# EAGLE board electrosteel2020_controlonly (EAGLE 9.2.2), part 1 of 3
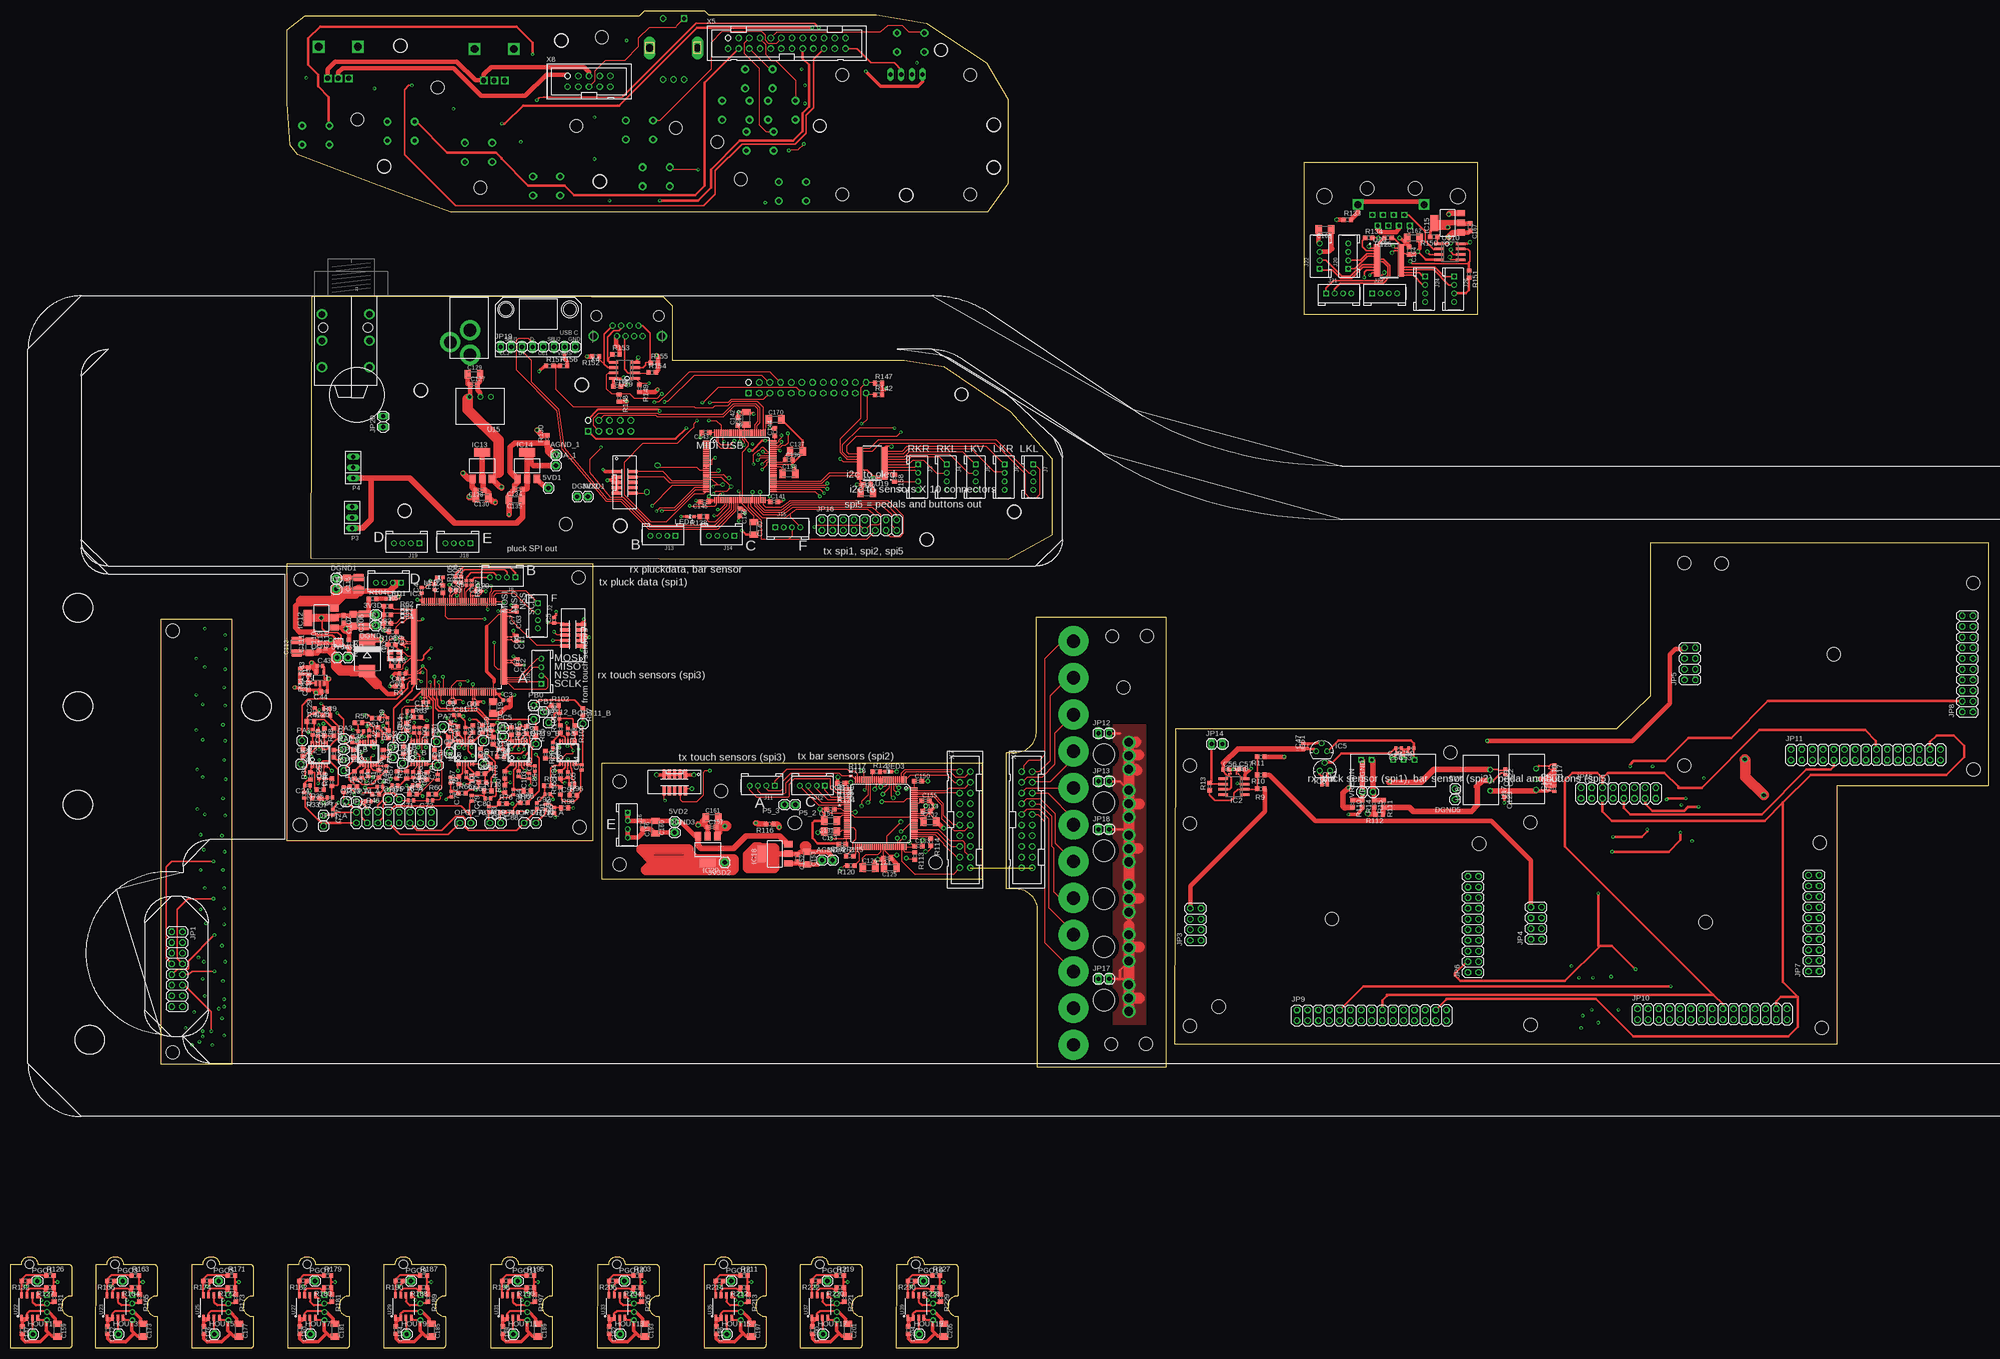
[diagram p7: board, top side]
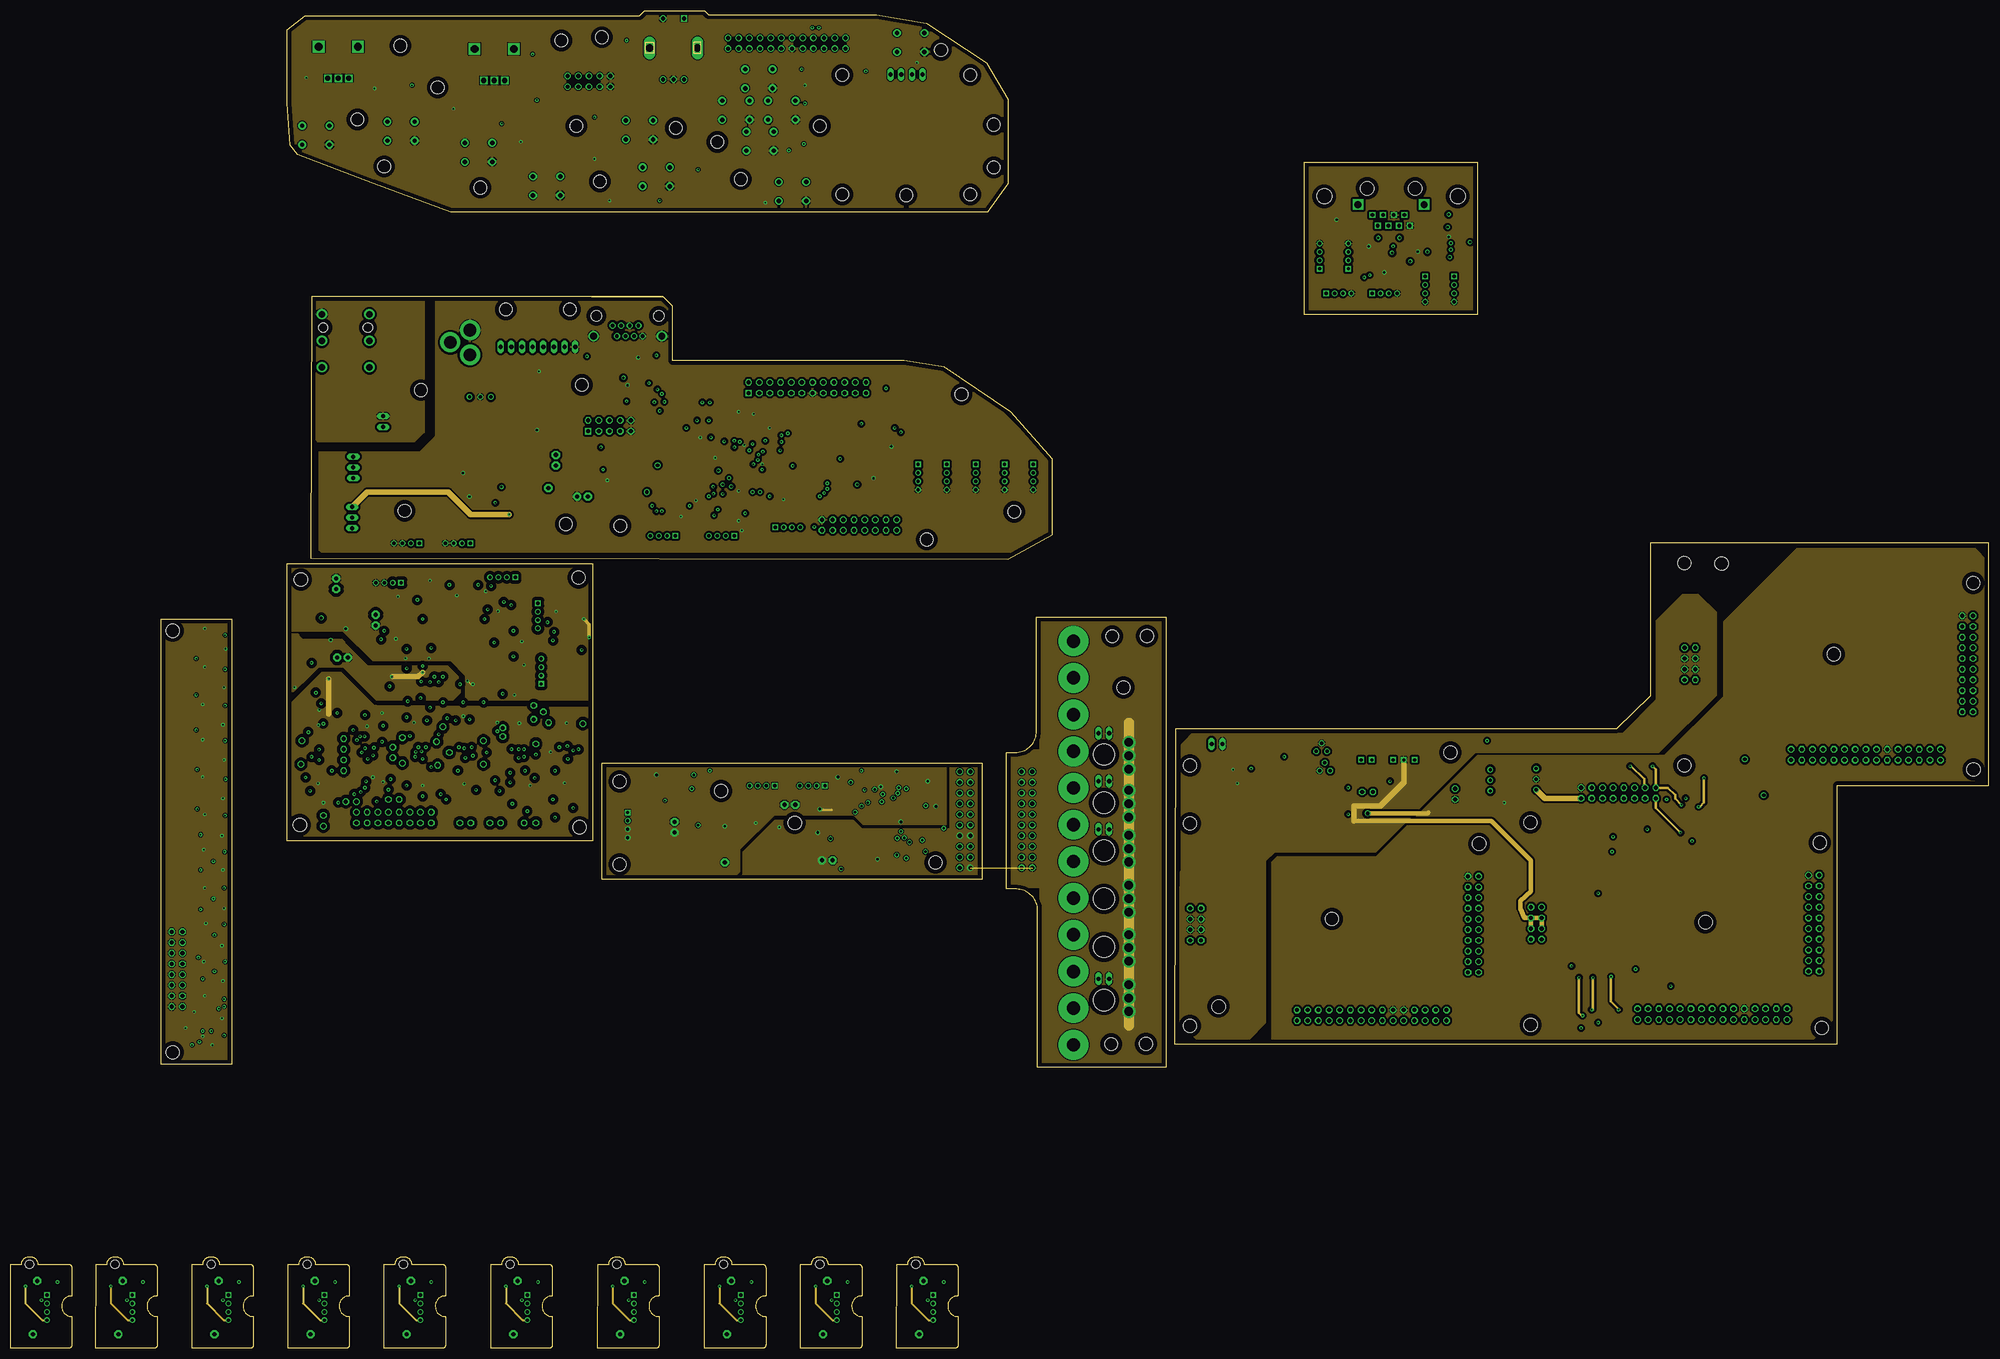
[diagram p8: board, inner layer Route2]
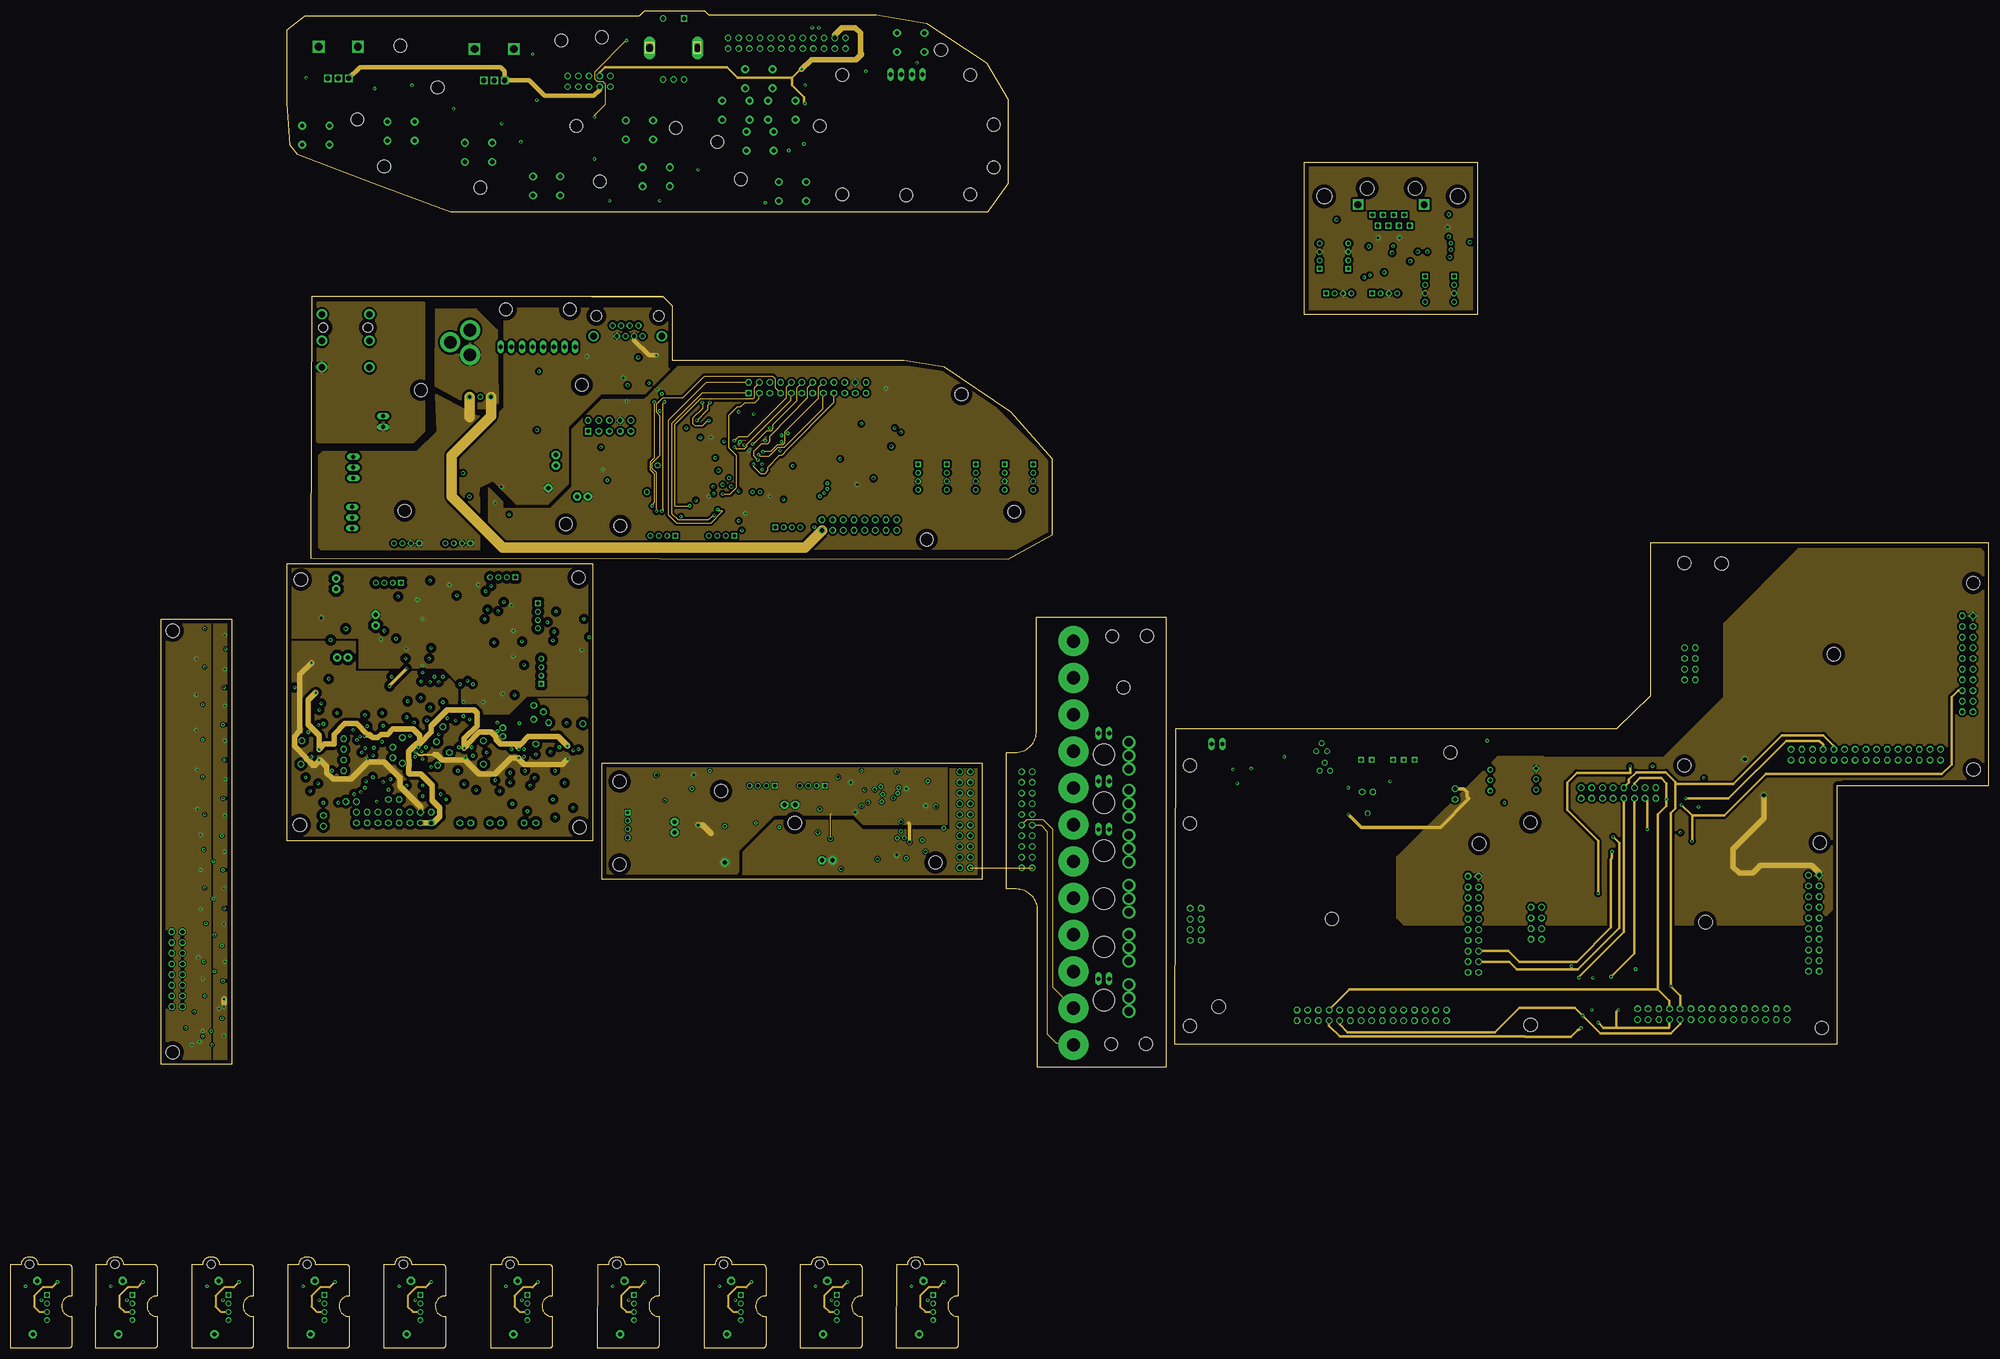
[diagram p9: board, inner layer Route15]
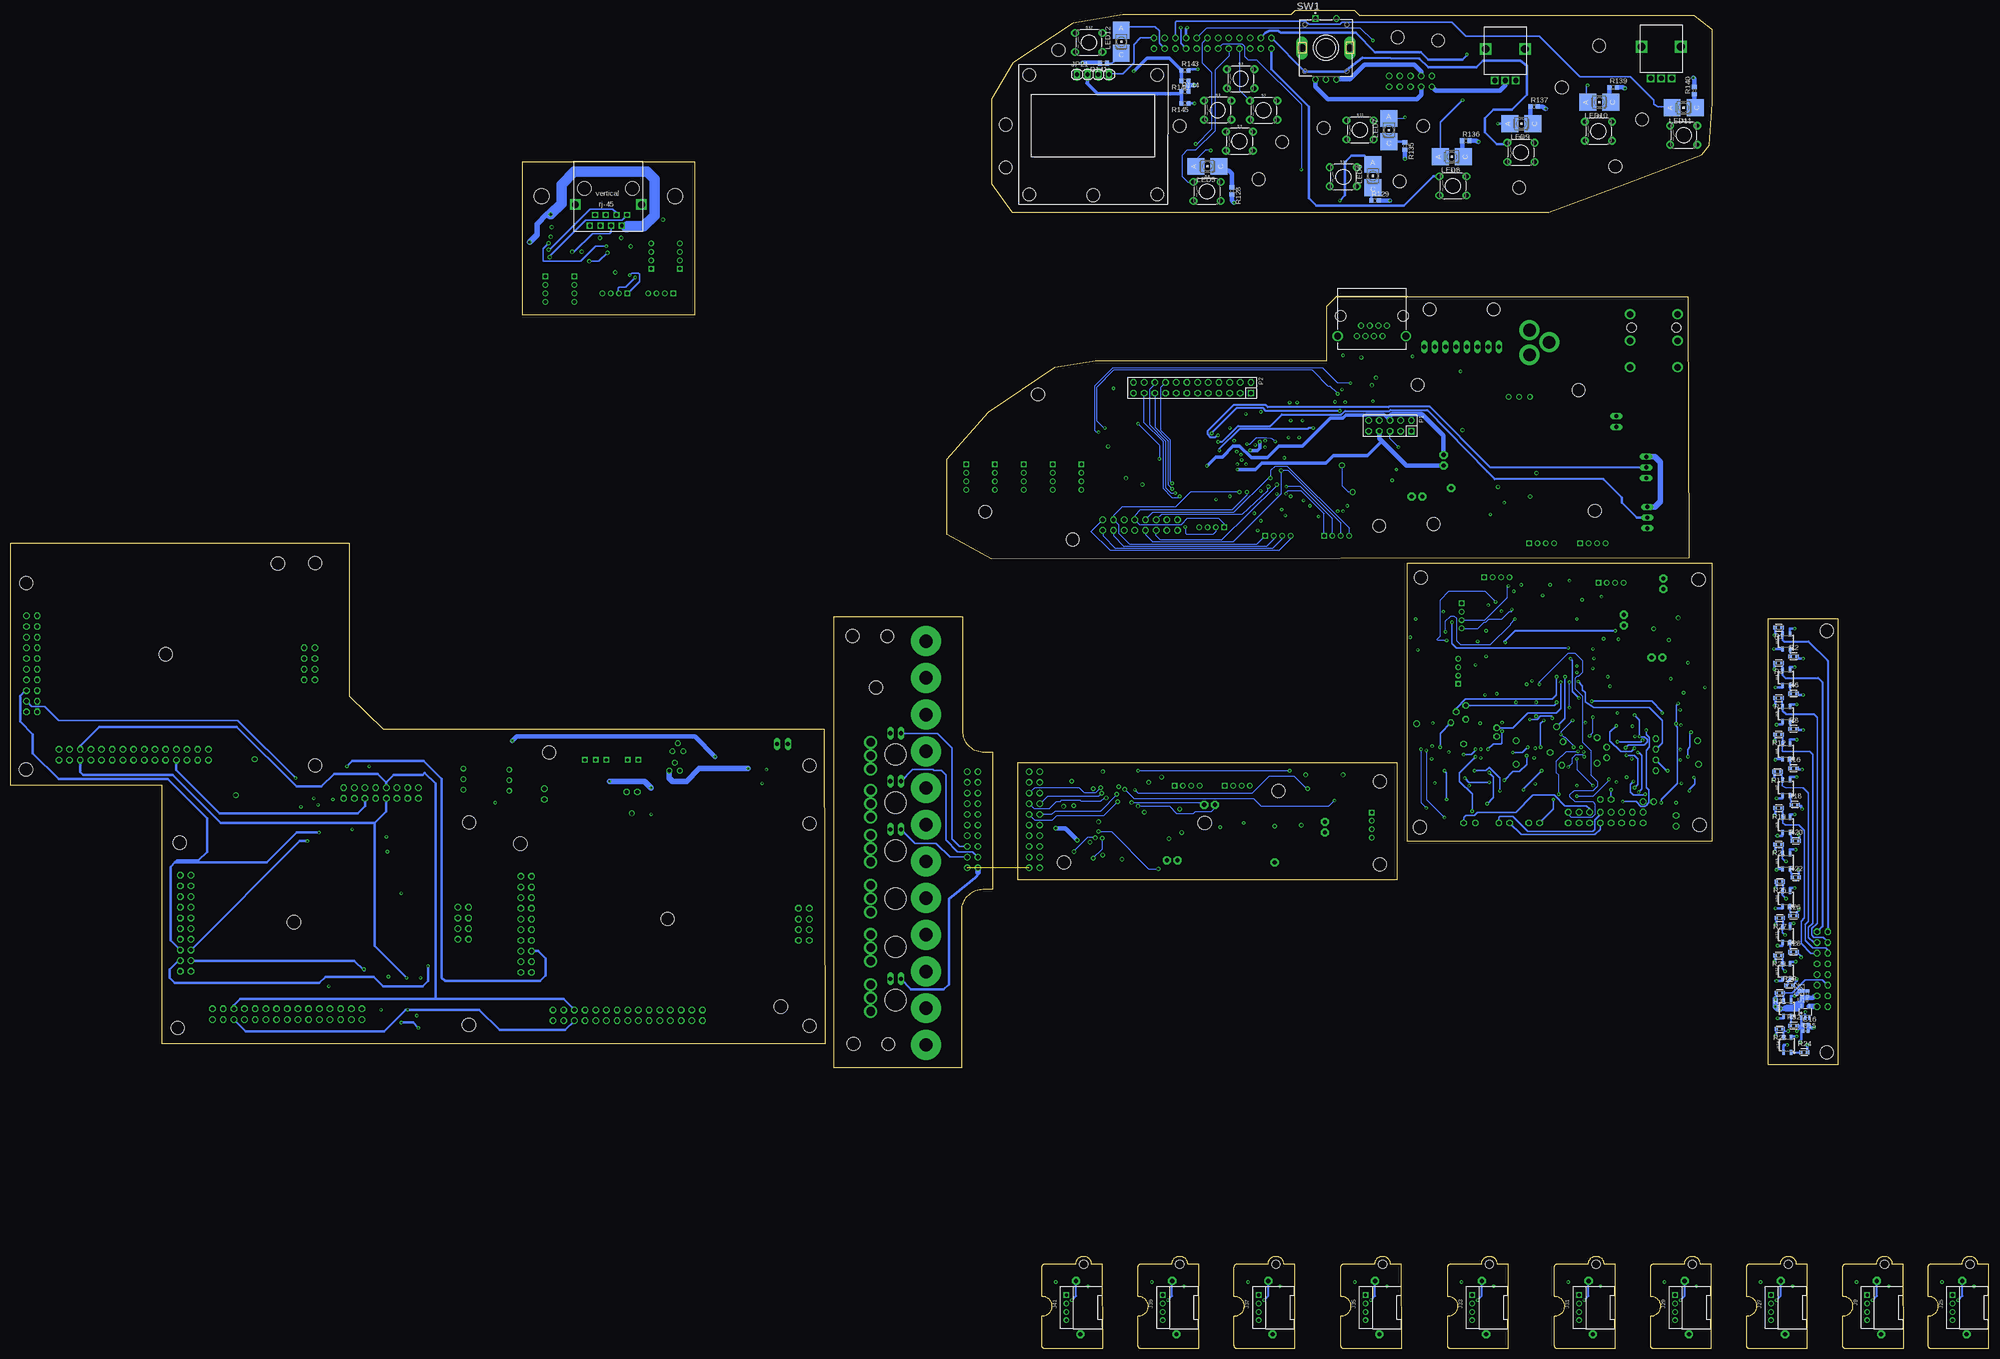
[diagram p10: board, bottom side, seen from below]

Size 470.66 x 318.31 mm. Coordinates in mm from the lower left corner, seen from the top.
Outline: 213 segments
Copper layers (1+2*15+16): Top 0.035mm / dielectric 0.5mm / Route2 0.035mm / dielectric 0.5mm / Route15 0.035mm / dielectric 0.5mm / Bottom 0.035mm
Design rules "default *": minimum track width 6mil, minimum drill 0.35mm, track to track 9mil, track to pad 9mil, pad to pad 9mil, via to via 9mil, smd to smd 9mil, copper to edge 40mil, drill to drill 6mil, minimum pad ring 10mil, minimum via ring 8mil, stop-mask expansion 4mil, vias tented up to drill 0mil, thermal gap 10mil
Holes 3.17 mm at 280.54,124.89 349.38,120.07 280.54,76.76 361.57,125.15 430.4,120.32 361.62,76.99 398.15,186.89 466.95,182.07 398.22,138.71 270.13,72.44 144.91,134.92 264.8,157.28 68.83,124.51 69.09,182.93 135.13,183.44 135.38,124 314.32,102.16 403.23,101.4 433.71,165.15 342.52,141.78 280.54,138.73 466.98,137.72 407.04,186.74 287.4,81.33 430.91,76.25 270.38,169.47 186.56,125.02 220.09,115.62 169.04,132.64 144.91,115.11 38.61,170.74 38.61,70.41
Holes 5.08 mm at 260.1,141.27 260.1,129.84 260.1,118.41 260.1,106.98 260.1,95.55 260.1,82.85
Holes 2.03 mm at 4.55,20.02 24.87,20.02 47.73,20.02 70.59,20.02 93.45,20.02 118.85,20.02 144.25,20.02 169.65,20.02 192.51,20.02 215.37,20.02
Holes 3.56 mm at 312.55,274.12 344.3,274.12
Holes 3.05 mm at 117.86,247.19 133.1,247.19 197.91,274.57 228.31,274.57 228.31,302.97 197.91,302.97 221.36,308.91 233.93,291.13 192.53,290.88 213.11,274.37 140.21,277.67 88.9,281.23 131.06,311.2 92.71,309.93 97.58,227.99 135.94,229.26 93.77,199.29 145.08,195.72 217.97,192.43 226.24,226.96 233.93,280.97 238.81,199.03 111.76,276.15 101.6,300.02 82.55,292.4 134.62,290.88 158.24,290.37 173.74,278.18 168.15,287.07 140.72,311.96 132.08,196.14 261.87,72.44 262.13,169.47

## Footprints (pad centres in the part's own frame; a part is rotated, then mirrored left to right if it is on the bottom)
1X01 = drill 1.016 pad 1.93 octagon: 1 0,0
1X01' = drill 1.016 octagon: 1 0,0
C0402 = smd 0.7 x 0.9: 1 -0.65,0; 2 0.65,0
C0201 = smd 0.25 x 0.35: 1 -0.25,0; 2 0.25,0
C0603 = smd 1.1 x 1: 1 -0.85,0; 2 0.85,0
C1206 = smd 1.6 x 1.8: 1 -1.4,0; 2 1.4,0
SMC_B = smd 1.6 x 2.4: + -1.5,0; - 1.5,0
C0603K = smd 1.05 x 1.08: 1 -0.875,0; 2 0.875,0
C1206K = smd 1.5 x 2: 1 -1.5,0; 2 1.5,0
SMC = smd 2.8 x 3.8: A 3.7,0; C -3.7,0
TSSOP14 = smd 0.305 x 0.991: 1 -1.905,-2.718; 2 -1.27,-2.718; 3 -0.635,-2.718; 4 0,-2.718; 5 0.635,-2.718; 6 1.27,-2.718; 7 1.905,-2.718; 8 1.905,2.718; 9 1.27,2.718; 10 0.635,2.718; 11 0,2.718; 12 -0.635,2.718; 13 -1.27,2.718; 14 -1.905,2.718
SO08 = smd 0.6 x 2.2: 1 -1.905,-2.6; 2 -0.635,-2.6; 3 0.635,-2.6; 4 1.905,-2.6; 5 1.905,2.6; 6 0.635,2.6; 7 -0.635,2.6; 8 -1.905,2.6
QFP50P2200X2200X160-144N = smd 1.56 x 0.28: 1 -10.68,8.75; 2 -10.68,8.25; 3 -10.68,7.75; 4 -10.68,7.25; 5 -10.68,6.75; 6 -10.68,6.25; 7 -10.68,5.75; 8 -10.68,5.25; 9 -10.68,4.75; 10 -10.68,4.25; 11 -10.68,3.75; 12 -10.68,3.25; 13 -10.68,2.75; 14 -10.68,2.25; 15 -10.68,1.75; 16 -10.68,1.25; 17 -10.68,0.75; 18 -10.68,0.25; 19 -10.68,-0.25; 20 -10.68,-0.75; 21 -10.68,-1.25; 22 -10.68,-1.75; 23 -10.68,-2.25; 24 -10.68,-2.75; 25 -10.68,-3.25; 26 -10.68,-3.75; 27 -10.68,-4.25; 28 -10.68,-4.75; 29 -10.68,-5.25; 30 -10.68,-5.75; 31 -10.68,-6.25; 32 -10.68,-6.75; 33 -10.68,-7.25; 34 -10.68,-7.75; 35 -10.68,-8.25; 36 -10.68,-8.75; 73 10.68,-8.75; 74 10.68,-8.25; 75 10.68,-7.75; 76 10.68,-7.25; 77 10.68,-6.75; 78 10.68,-6.25; 79 10.68,-5.75; 80 10.68,-5.25; 81 10.68,-4.75; 82 10.68,-4.25; 83 10.68,-3.75; 84 10.68,-3.25; 85 10.68,-2.75; 86 10.68,-2.25; 87 10.68,-1.75; 88 10.68,-1.25; 89 10.68,-0.75; 90 10.68,-0.25; 91 10.68,0.25; 92 10.68,0.75; 93 10.68,1.25; 94 10.68,1.75; 95 10.68,2.25; 96 10.68,2.75; 97 10.68,3.25; 98 10.68,3.75; 99 10.68,4.25; 100 10.68,4.75; 101 10.68,5.25; 102 10.68,5.75; 103 10.68,6.25; 104 10.68,6.75; 105 10.68,7.25; 106 10.68,7.75; 107 10.68,8.25; 108 10.68,8.75 | smd 0.28 x 1.56: 37 -8.75,-10.68; 38 -8.25,-10.68; 39 -7.75,-10.68; 40 -7.25,-10.68; 41 -6.75,-10.68; 42 -6.25,-10.68; 43 -5.75,-10.68; 44 -5.25,-10.68; 45 -4.75,-10.68; 46 -4.25,-10.68; 47 -3.75,-10.68; 48 -3.25,-10.68; 49 -2.75,-10.68; 50 -2.25,-10.68; 51 -1.75,-10.68; 52 -1.25,-10.68; 53 -0.75,-10.68; 54 -0.25,-10.68; 55 0.25,-10.68; 56 0.75,-10.68; 57 1.25,-10.68; 58 1.75,-10.68; 59 2.25,-10.68; 60 2.75,-10.68; 61 3.25,-10.68; 62 3.75,-10.68; 63 4.25,-10.68; 64 4.75,-10.68; 65 5.25,-10.68; 66 5.75,-10.68; 67 6.25,-10.68; 68 6.75,-10.68; 69 7.25,-10.68; 70 7.75,-10.68; 71 8.25,-10.68; 72 8.75,-10.68; 109 8.75,10.68; 110 8.25,10.68; 111 7.75,10.68; 112 7.25,10.68; 113 6.75,10.68; 114 6.25,10.68; 115 5.75,10.68; 116 5.25,10.68; 117 4.75,10.68; 118 4.25,10.68; 119 3.75,10.68; 120 3.25,10.68; 121 2.75,10.68; 122 2.25,10.68; 123 1.75,10.68; 124 1.25,10.68; 125 0.75,10.68; 126 0.25,10.68; 127 -0.25,10.68; 128 -0.75,10.68; 129 -1.25,10.68; 130 -1.75,10.68; 131 -2.25,10.68; 132 -2.75,10.68; 133 -3.25,10.68; 134 -3.75,10.68; 135 -4.25,10.68; 136 -4.75,10.68; 137 -5.25,10.68; 138 -5.75,10.68; 139 -6.25,10.68; 140 -6.75,10.68; 141 -7.25,10.68; 142 -7.75,10.68; 143 -8.25,10.68; 144 -8.75,10.68
SOT23-5 = smd 0.6 x 1.2: 1 -0.95,-1.306; 2 0,-1.306; 3 0.95,-1.306; 4 0.95,1.306; 5 -0.95,1.306
78LXX = drill 0.813 octagon: GND 0,1.905; IN 1.27,0; OUT -1.27,0
79LXX = drill 0.813 octagon: GND -1.27,0; IN 0,1.905; OUT 1.27,0
6-WSON = smd 0.45 x 0.3: 1 -0.975,0.65; 2 -0.975,0; 3 -0.975,-0.65; 4 0.975,-0.65; 5 0.975,0; 6 0.975,0.65 | smd 0.9 x 1.6: PAD 0,0
SOT223 = smd 1.499 x 2.007: 1 -2.261,-3.15; 2 0.025,-3.15; 3 2.311,-3.15 | smd 3.81 x 2.007: PAD 0,3.15
AUDIO_JACK_0.25"_TRS_PTH_RA = drill 1.6: RING 10.5,-6.95; RING-NORM 10.5,4.35; SLEEVE 4.2,-6.95; SLEEVE-NORM 4.2,4.35; TIP 16.8,-6.95; TIP-NORM 16.8,4.35 | hole 2.2: 7.4,4; 7.4,-6.6
HW4-2.0 = drill 0.8 pad 1.27 square: 1 -3,0 | drill 0.8 pad 1.27: 2 -1,0; 3 1,0; 4 3,0
HW4-2.0-90D = drill 0.8 pad 1.27 square: 1 -3,0 | drill 0.8 pad 1.27: 2 -1,0; 3 1,0; 4 3,0
2X08 = drill 1.016 octagon: 1 -8.89,-1.27; 2 -8.89,1.27; 3 -6.35,-1.27; 4 -6.35,1.27; 5 -3.81,-1.27; 6 -3.81,1.27; 7 -1.27,-1.27; 8 -1.27,1.27; 9 1.27,-1.27; 10 1.27,1.27; 11 3.81,-1.27; 12 3.81,1.27; 13 6.35,-1.27; 14 6.35,1.27; 15 8.89,-1.27; 16 8.89,1.27
2X04 = drill 1.016 octagon: 1 -3.81,-1.27; 2 -3.81,1.27; 3 -1.27,-1.27; 4 -1.27,1.27; 5 1.27,-1.27; 6 1.27,1.27; 7 3.81,-1.27; 8 3.81,1.27
2X10 = drill 1.016 octagon: 1 -11.43,-1.27; 2 -11.43,1.27; 3 -8.89,-1.27; 4 -8.89,1.27; 5 -6.35,-1.27; 6 -6.35,1.27; 7 -3.81,-1.27; 8 -3.81,1.27; 9 -1.27,-1.27; 10 -1.27,1.27; 11 1.27,-1.27; 12 1.27,1.27; 13 3.81,-1.27; 14 3.81,1.27; 15 6.35,-1.27; 16 6.35,1.27; 17 8.89,-1.27; 18 8.89,1.27; 19 11.43,-1.27; 20 11.43,1.27
2X15 = drill 1.016 octagon: 1 -17.78,-1.27; 2 -17.78,1.27; 3 -15.24,-1.27; 4 -15.24,1.27; 5 -12.7,-1.27; 6 -12.7,1.27; 7 -10.16,-1.27; 8 -10.16,1.27; 9 -7.62,-1.27; 10 -7.62,1.27; 11 -5.08,-1.27; 12 -5.08,1.27; 13 -2.54,-1.27; 14 -2.54,1.27; 15 0,-1.27; 16 0,1.27; 17 2.54,-1.27; 18 2.54,1.27; 19 5.08,-1.27; 20 5.08,1.27; 21 7.62,-1.27; 22 7.62,1.27; 23 10.16,-1.27; 24 10.16,1.27; 25 12.7,-1.27; 26 12.7,1.27; 27 15.24,-1.27; 28 15.24,1.27; 29 17.78,-1.27; 30 17.78,1.27
1X02 = drill 1.016 long: 1 -1.27,0; 2 1.27,0
1X08 = drill 1.016 long: 1 -8.89,0; 2 -6.35,0; 3 -3.81,0; 4 -1.27,0; 5 1.27,0; 6 3.81,0; 7 6.35,0; 8 8.89,0
1X04 = drill 1.016 long: 1 -3.81,0; 2 -1.27,0; 3 1.27,0; 4 3.81,0
CHIP-LED0603 = smd 0.8 x 0.8: A 0,-0.75; C 0,0.75
P-LCC-2 = smd 4 x 4: A 0,2.75; C 0,-2.75
DIL-100-2X05_M = drill 1.016 square: 1 -5.08,1.27 | drill 1.016 octagon: 2 -5.08,-1.27; 3 -2.54,1.27; 4 -2.54,-1.27; 5 0,1.27; 6 0,-1.27; 7 2.54,1.27; 8 2.54,-1.27; 9 5.08,1.27; 10 5.08,-1.27
DIL-100-2X12_M = drill 1.016 square: 1 -13.97,1.27 | drill 1.016 octagon: 2 -13.97,-1.27; 3 -11.43,1.27; 4 -11.43,-1.27; 5 -8.89,1.27; 6 -8.89,-1.27; 7 -6.35,1.27; 8 -6.35,-1.27; 9 -3.81,1.27; 10 -3.81,-1.27; 11 -1.27,1.27; 12 -1.27,-1.27; 13 1.27,1.27; 14 1.27,-1.27; 15 3.81,1.27; 16 3.81,-1.27; 17 6.35,1.27; 18 6.35,-1.27; 19 8.89,1.27; 20 8.89,-1.27; 21 11.43,1.27; 22 11.43,-1.27; 23 13.97,1.27; 24 13.97,-1.27
SIP-100-03-40Y = drill 1.016 long: 1 -2.54,0; 2 0,0; 3 2.54,0
NX3225 = smd 1.4 x 1.2: 1 -1.1,-0.8; 2 1.1,-0.8; 3 1.1,0.8; 4 -1.1,0.8
RESC1608X60 = smd 0.799 x 0.974: 1 -0.815,0; 2 0.815,0
R0603 = smd 1 x 1.1: 1 -0.85,0; 2 0.85,0
R0402 = smd 0.7 x 0.9: 1 -0.55,0; 2 0.55,0
R0201 = smd 0.28 x 0.43: 1 -0.255,0; 2 0.255,0
TACTILE_SWITCH_PTH_6.0MM = drill 1.016 pad 1.88: 1 -3.251,2.261; 2 3.251,2.261; 3 -3.251,-2.261; 4 3.251,-2.261
PEC11R-4215F-S0024 = drill 1 square: 1 -2.5,7 | drill 1: 2 2.5,7; A -2.5,-7.5; B 2.5,-7.5; C 0,-7.5 | drill 1.8 long: P1 -5.7,0; P2 5.7,0
TQFP-100-14X14MM = smd 1.5 x 0.27: 1 -8,6; 2 -8,5.5; 3 -8,5; 4 -8,4.5; 5 -8,4; 6 -8,3.5; 7 -8,3; 8 -8,2.5; 9 -8,2; 10 -8,1.5; 11 -8,1; 12 -8,0.5; 13 -8,0; 14 -8,-0.5; 15 -8,-1; 16 -8,-1.5; 17 -8,-2; 18 -8,-2.5; 19 -8,-3; 20 -8,-3.5; 21 -8,-4; 22 -8,-4.5; 23 -8,-5; 24 -8,-5.5; 25 -8,-6; 51 8,-6; 52 8,-5.5; 53 8,-5; 54 8,-4.5; 55 8,-4; 56 8,-3.5; 57 8,-3; 58 8,-2.5; 59 8,-2; 60 8,-1.5; 61 8,-1; 62 8,-0.5; 63 8,0; 64 8,0.5; 65 8,1; 66 8,1.5; 67 8,2; 68 8,2.5; 69 8,3; 70 8,3.5; 71 8,4; 72 8,4.5; 73 8,5; 74 8,5.5; 75 8,6 | smd 0.27 x 1.5: 26 -6,-8; 27 -5.5,-8; 28 -5,-8; 29 -4.5,-8; 30 -4,-8; 31 -3.5,-8; 32 -3,-8; 33 -2.5,-8; 34 -2,-8; 35 -1.5,-8; 36 -1,-8; 37 -0.5,-8; 38 0,-8; 39 0.5,-8; 40 1,-8; 41 1.5,-8; 42 2,-8; 43 2.5,-8; 44 3,-8; 45 3.5,-8; 46 4,-8; 47 4.5,-8; 48 5,-8; 49 5.5,-8; 50 6,-8; 76 6,8; 77 5.5,8; 78 5,8; 79 4.5,8; 80 4,8; 81 3.5,8; 82 3,8; 83 2.5,8; 84 2,8; 85 1.5,8; 86 1,8; 87 0.5,8; 88 0,8; 89 -0.5,8; 90 -1,8; 91 -1.5,8; 92 -2,8; 93 -2.5,8; 94 -3,8; 95 -3.5,8; 96 -4,8; 97 -4.5,8; 98 -5,8; 99 -5.5,8; 100 -6,8
QRE1113 = smd 1.2 x 0.6: 1 -1.8,-0.9; 2 1.8,-0.9; 3 1.8,0.9; 4 -1.8,0.9
DC-DC_CONVERTER_78XX = drill 0.8: GND 0,0; VIN -2.54,0; VOUT 2.54,0
TEXAS_SOT23-5 = smd 0.55 x 1.2: 1 -0.95,-1.3; 2 0,-1.3; 3 0.95,-1.3; 4 0.95,1.3; 5 -0.95,1.3
SOP65P640X120-24N = smd 1.57 x 0.41: 1 -2.87,3.575; 2 -2.87,2.925; 3 -2.87,2.275; 4 -2.87,1.625; 5 -2.87,0.975; 6 -2.87,0.325; 7 -2.87,-0.325; 8 -2.87,-0.975; 9 -2.87,-1.625; 10 -2.87,-2.275; 11 -2.87,-2.925; 12 -2.87,-3.575; 13 2.87,-3.575; 14 2.87,-2.925; 15 2.87,-2.275; 16 2.87,-1.625; 17 2.87,-0.975; 18 2.87,-0.325; 19 2.87,0.325; 20 2.87,0.975; 21 2.87,1.625; 22 2.87,2.275; 23 2.87,2.925; 24 2.87,3.575
SOIC8-1.27-5X4MM = smd 0.6 x 1.4: 1 -1.905,-2.7; 2 -0.635,-2.7; 3 0.635,-2.7; 4 1.905,-2.7; 5 1.905,2.7; 6 0.635,2.7; 7 -0.635,2.7; 8 -1.905,2.7
RK09 = drill 1.2 square: 1-09 -2.5,-7.5; 2-09 0,-7.5; 3-09 2.5,-7.5 | drill 1.854 square: MOUNT1 -4.683,0; MOUNT2 4.683,0
CMR0512S3C = drill 0.8 square: P$1 -7.62,0; P$2 -5.08,0; P$3 0,0; P$4 2.54,0; P$5 5.08,0
SS-7188VS-A-FLS_RJ45 = drill 0.889 square: P$1 -4.445,4.445; P$2 -3.175,6.985; P$3 -1.905,4.445; P$4 -0.635,6.985; P$5 0.635,4.445; P$6 1.905,6.985; P$7 3.175,4.445; P$8 4.445,6.985 | drill 1.651 square: P$9 -7.874,1.981; P$10 7.874,1.981 | hole 3.277: -5.715,-1.905; 5.715,-1.905
SO8 = smd 0.6 x 2.2: 1 -1.905,-2.6; 2 -0.635,-2.6; 3 0.635,-2.6; 4 1.905,-2.6; 5 1.905,2.6; 6 0.635,2.6; 7 -0.635,2.6; 8 -1.905,2.6
PJ-102A = drill 3 pad 4.8: RING 0.1,-3.39; RING_SW -4.6,-6.29; TIP 0.1,-9.29
3221-10-0300-00 = smd 0.76 x 2.4: 1 -2.54,-1.87; 2 -2.54,1.97; 3 -1.27,-1.87; 4 -1.27,1.97; 5 0,-1.87; 6 0,1.97; 7 1.27,-1.87; 8 1.27,1.97; 9 2.54,-1.87; 10 2.54,1.97
GLX-S-88M = drill 0.9 pad 1.422: 1 -3.57,-2.3; 2 -2.55,-4.84; 3 -1.53,-2.3; 4 -0.51,-4.84; 5 0.51,-2.3; 6 1.53,-4.84; 7 2.55,-2.3; 8 3.57,-4.84 | drill 1.6 pad 2.184: S1 -8.125,-4.84; S2 8.125,-4.84 | hole 2.55: -7.44,0; 7.44,0
PAK100/2500-24 = drill 1 pad 1.422: 1 -13.97,-1.27; 2 -13.97,1.27; 3 -11.43,-1.27; 4 -11.43,1.27; 5 -8.89,-1.27; 6 -8.89,1.27; 7 -6.35,-1.27; 8 -6.35,1.27; 9 -3.81,-1.27; 10 -3.81,1.27; 11 -1.27,-1.27; 12 -1.27,1.27; 13 1.27,-1.27; 14 1.27,1.27; 15 3.81,-1.27; 16 3.81,1.27; 17 6.35,-1.27; 18 6.35,1.27; 19 8.89,-1.27; 20 8.89,1.27; 21 11.43,-1.27; 22 11.43,1.27; 23 13.97,-1.27; 24 13.97,1.27
PAK100/2500-20 = drill 1 pad 1.422: 1 -11.43,-1.27; 2 -11.43,1.27; 3 -8.89,-1.27; 4 -8.89,1.27; 5 -6.35,-1.27; 6 -6.35,1.27; 7 -3.81,-1.27; 8 -3.81,1.27; 9 -1.27,-1.27; 10 -1.27,1.27; 11 1.27,-1.27; 12 1.27,1.27; 13 3.81,-1.27; 14 3.81,1.27; 15 6.35,-1.27; 16 6.35,1.27; 17 8.89,-1.27; 18 8.89,1.27; 19 11.43,-1.27; 20 11.43,1.27
PAK100/2500-10 = drill 1 pad 1.422: 1 -5.08,-1.27; 2 -5.08,1.27; 3 -2.54,-1.27; 4 -2.54,1.27; 5 0,-1.27; 6 0,1.27; 7 2.54,-1.27; 8 2.54,1.27; 9 5.08,-1.27; 10 5.08,1.27

## Placement (x,y rotation side)
3V3A  [1X01]  77.72,164.39 0 top
3V3A_1  [1X01]  129.73,210.03 0 top
3V3A_2  [1X01]  195.58,116.13 0 top
3V3D  [1X01]  86.87,174.55 0 top
3V3D1  [1X01]  137.35,202.67 0 top
3V3D2  [1X01]  169.93,115.62 180 top
5V  [1X01]  77.47,180.64 0 top
5V/1  PINHD-1X1  [1X01']  343.66,133.15 0 top
5VD1  [1X01]  127.96,204.7 0 top
5VD2  [1X01]  157.99,125.27 0 top
AGND  [1X01]  80.26,164.39 0 top
AGND_1  [1X01]  129.73,212.57 0 top
AGND_2  [1X01]  193.04,116.13 0 top
C1  .1uf  [C0402]  105.16,153.72 180 top
C2  .1uf  [C0402]  93.22,168.2 90 top
C3  .1uf  [C0402]  117.86,154.23 0 top
C4  .1uf  [C0402]  97.79,180.39 90 top
C5  .1uf  [C0402]  129.29,173.28 90 top
C6  .01uf  [C0201]  110.19,154.61 180 top
C7  .01uf  [C0201]  118.87,175.31 270 top
C8  .01uf  [C0201]  105.16,154.74 180 top
C9  .01uf  [C0201]  94.23,167.94 90 top
C10  .01uf  [C0201]  98.68,154.76 180 top
C11  .1uf  [C0402]  120.4,168.96 270 top
C12  .1uf  [C0402]  120.65,163.37 270 top
C13  .1uf  [C0402]  110.49,153.47 180 top
C14  .1uf  [C0402]  98.81,153.72 180 top
C15  .1uf  [C0402]  43.69,75.49 0 bottom
C16  .01uf  [C0402]  43.69,77.01 0 bottom
C17  18pf  [C0603]  90.68,167.44 180 top
C18  18pf  [C0603]  91.44,162.36 0 top
C19  2.2uf  [C1206]  114.81,152.45 270 top
C20  .1uf  [C0402]  111.25,180.14 0 top
C21  .01uf  [C0402]  43.18,84.38 90 bottom
C22  .1uf  [C0402]  44.45,84.38 90 bottom
C23  .1uf  [C0402]  69.85,131.62 270 top
C24  .1uf  [C0402]  70.61,133.91 180 top
C25  .1uf  [C0402]  74.68,136.19 90 top
C26  .1uf  [C0402]  75.95,131.11 180 top
C27  .1uf  [C0402]  76.71,127.56 270 top
C28  .1uf  [C0402]  75.18,152.2 180 top
C29  .1uf  [C0402]  72.39,151.69 90 top
C30  .1uf  [C0402]  71.88,146.61 270 top
C31  .1uf  [C0402]  68.83,161.09 270 top
C32  .1uf  [C0402]  68.83,157.78 270 top
C33  .1uf  [C0402]  79.25,132.89 270 top
C34  .1uf  [C0402]  83.57,136.45 270 top
C35  .1uf  [C0402]  87.88,133.65 0 top
C36  .1uf  [C0402]  89.41,137.97 90 top
C37  .1uf  [C0402]  85.09,130.1 180 top
C38  .1uf  [C0402]  83.31,146.86 180 top
C39  .1uf  [C0402]  89.66,149.4 90 top
C40  .1uf  [C0402]  81.28,144.83 270 top
C41  .1uf  [C0402]  85.09,136.7 270 top
C42  .1uf  [C0402]  85.34,146.35 270 top
C43  .1uf  [C0402]  73.66,162.36 0 top
C44  .1uf  [C0402]  74.68,156.26 180 top
C45  .1uf  [C0402]  73.41,136.19 270 top
C46  .1uf  [C0402]  73.15,146.35 270 top
C47  .1uf  [C0402]  307.59,143.31 90 top
C48  .1uf  [C0402]  312.67,134.16 0 top
C49  .1uf  [C0402]  330.2,142.8 180 top
C50  .1uf  [C0402]  333.25,142.8 180 top
C51  .01uf  [C0201]  308.61,143.31 90 top
C52  .01uf  [C0201]  312.67,135.18 0 top
C53  .01uf  [C0201]  332.74,141.78 180 top
C54  .01uf  [C0201]  330.45,141.78 180 top
C55  .1uf  [C0402]  105.41,180.45 0 top
C56  .1uf  [C0402]  289.05,137.72 0 top
C57  .1uf  [C0402]  292.86,137.72 0 top
C58  .01uf  [C0201]  290.07,136.7 0 top
C59  .01uf  [C0201]  291.85,136.7 0 top
C60  .1uf  [C0402]  91.44,133.91 180 top
C61  .1uf  [C0402]  95.76,136.45 270 top
C62  .1uf  [C0402]  96.27,133.91 0 top
C63  .1uf  [C0402]  120.4,175.82 270 top
C64  .01uf  [C0402]  93.22,160.58 180 top
C65  .01uf  [C0402]  92.68,159.31 180 top
C66  .01uf  [C0201]  119.13,168.96 270 top
C67  .01uf  [C0201]  119.15,163.45 270 top
C68  .01uf  [C0201]  109.73,179.12 0 top
C69  .01uf  [C0201]  104.67,179.12 0 top
C70  .1uf  [C0402]  101.6,135.94 90 top
C71  .1uf  [C0402]  95.25,130.35 180 top
C72  .1uf  [C0402]  99.82,130.35 180 top
C73  .1uf  [C0402]  96.01,147.12 90 top
C74  .1uf  [C0402]  95,151.69 180 top
C75  .1uf  [C0402]  104.9,131.88 270 top
C76  .1uf  [C0402]  104.65,135.18 270 top
C77  .1uf  [C0402]  109.73,135.69 270 top
C78  .1uf  [C0402]  114.3,138.48 90 top
C79  .1uf  [C0402]  109.73,130.86 270 top
C80  .1uf  [C0402]  113.54,130.86 180 top
C81  .1uf  [C0402]  106.1,150.73 0 top
C82  .1uf  [C0402]  104.65,147.88 270 top
C83  .1uf  [C0402]  113.79,128.32 270 top
C84  .1uf  [C0402]  119.63,132.38 270 top
C85  .1uf  [C0402]  123.44,136.19 270 top
C86  .1uf  [C0402]  124.71,137.97 90 top
C87  .1uf  [C0402]  117.09,127.56 180 top
C88  .1uf  [C0402]  120.14,127.56 180 top
C89  .1uf  [C0402]  114.55,147.62 90 top
C90  .1uf  [C0402]  116.59,142.54 0 top
C91  .1uf  [C0402]  125.22,129.08 270 top
C92  .1uf  [C0402]  127.76,131.88 180 top
C93  .1uf  [C0402]  133.6,134.16 180 top
C94  .1uf  [C0402]  135.89,138.23 90 top
C95  .1uf  [C0402]  127.25,128.83 270 top
C96  .1uf  [C0402]  129.29,128.07 90 top
C97  .1uf  [C0402]  129.03,143.56 270 top
C98  .1uf  [C0402]  130.56,150.42 90 top
C99  .1uf  [C0402]  97.28,136.45 270 top
C100  .1uf  [C0402]  97.28,147.12 270 top
C101  .1uf  [C0402]  108.46,136.45 270 top
C102  .1uf  [C0402]  108.2,147.12 270 top
C103  .1uf  [C0402]  120.9,136.7 270 top
C104  .1uf  [C0402]  120.9,146.86 270 top
C105  .1uf  [C0402]  132.59,136.45 270 top
C106  .1uf  [C0402]  132.59,146.86 270 top
C107  .1uf  [C0603]  79.25,173.53 270 top
C108  1uf  [C1206]  81.53,173.28 270 top
C109  10uf  [SMC_B]  84.07,173.28 270 top
C110  .1uf  [C0603]  73.41,166.93 90 top
C111  1uf  [C1206]  71.12,166.93 90 top
C112  10uf  [SMC_B]  68.07,166.93 90 top
C113  .1uf  [C0402]  74.93,167.13 90 top
C114  1uf  [C1206]  80.01,181.91 90 top
C115  10uf  [SMC_B]  82.8,181.91 90 top
C116  .01uf  [C0201]  76.45,167.18 90 top
C117  .1uf  [C0402]  367.28,138.23 270 top
C118  .1uf  [C0402]  367.28,133.15 90 top
C119  .01uf  [C0201]  366.01,138.23 270 top
C120  .01uf  [C0201]  366.04,133.2 90 top
C121  .01uf  [C0201]  354.58,137.21 270 top
C122  .1uf  [C0402]  355.6,137.21 270 top
C123  .1uf  [C0402]  355.35,131.88 270 top
C124  .1uf  [C0603K]  208.53,116.64 180 top
C125  1uf  [C1206K]  209.3,114.35 180 top
C126  1uf  [C1206K]  204.22,114.35 0 top
C127  .1uf  [C0603K]  110.24,229.41 0 top
C128  .1uf  [C0603K]  111.7,204.19 180 top
C129  10uf  [C1206K]  110.24,231.7 0 top
C130  10uf  [C1206K]  112.21,202.41 180 top
C131  1uf  [C1206K]  195.07,125.53 180 top
C132  1uf  [C1206K]  218.69,125.27 0 top
C133  .1uf  [C0603K]  215.99,119.52 0 top
C134  .1uf  [C0603K]  120.84,204.44 180 top
C135  10uf  [C1206K]  120.08,201.9 180 top
C136  .1uf  [C0603K]  185.17,211.38 0 top
C137  1uf  [C1206K]  186.94,213.41 0 top
C138  1uf  [C1206K]  185.17,208.08 0 top
C139  1uf  [C1206K]  175.01,221.28 90 top
C140  1uf  [C1206K]  176.78,195.12 270 top
C141  .1uf  [C0603K]  181.61,201.47 0 top
C142  .1uf  [C0603K]  172.97,220.52 90 top
C143  .1uf  [C0603K]  165.35,217.98 180 top
C144  .1uf  [C0603K]  181.86,217.98 90 top
C145  .1uf  [C0603K]  165.1,201.47 180 top
C146  .1uf  [C0603K]  173.48,198.93 270 top
C147  .1uf  [C0603K]  2.79,4.37 270 top
C148  .1uf  [C0603K]  197.59,134.44 180 top
C149  .1uf  [C0603K]  197.87,119.94 180 top
C150  .1uf  [C0603K]  215.9,134.92 0 top
C151  .1uf  [C0603K]  195.07,128.32 180 top
C152  .1uf  [C0603K]  187.2,116.64 270 top
C153  10uf  [C1206K]  189.48,116.64 270 top
C154  .1uf  [C0603K]  217.91,127.76 0 top
C155  2200pf  [C0603K]  217.68,130.35 0 top
C156  .1uf  [C0603K]  150.37,124.51 270 top
C157  .1uf  [C0603K]  166.88,124 0 top
C159  1uf  [C1206K]  11.18,4.37 270 top
C160  10uf  [C1206K]  153.42,124 270 top
C161  10uf  [C1206K]  166.88,126.29 0 top
C162  1uf  [C1206K]  333.76,264.21 0 top
C163  1uf  [C1206K]  195.07,122.99 180 top
C164  .1uf  [C0603K]  332.74,261.16 270 top
C165  .1uf  [C0603K]  203.71,205.54 0 top
C166  .1uf  [C0603K]  144.27,228.9 0 top
C167  .1uf  [C0603K]  347.22,266.75 270 top
C168  10uf  [C1206K]  312.67,266.24 180 top
C169  1uf  [C1206K]  203.71,203.5 0 top
C170  1uf  [C1206K]  181.86,221.03 0 top
C172  .1uf  [C0603K]  23.11,4.37 270 top
C173  1uf  [C1206K]  31.5,4.37 270 top
C176  .1uf  [C0603K]  45.97,4.37 270 top
C177  1uf  [C1206K]  54.36,4.37 270 top
C180  .1uf  [C0603K]  68.83,4.37 270 top
C181  1uf  [C1206K]  77.22,4.37 270 top
C184  .1uf  [C0603K]  91.69,4.37 270 top
C185  1uf  [C1206K]  100.08,4.37 270 top
C188  .1uf  [C0603K]  117.09,4.37 270 top
C189  1uf  [C1206K]  125.48,4.37 270 top
C192  .1uf  [C0603K]  142.49,4.37 270 top
C193  1uf  [C1206K]  150.88,4.37 270 top
C196  .1uf  [C0603K]  167.89,4.37 270 top
C197  1uf  [C1206K]  176.28,4.37 270 top
C200  .1uf  [C0603K]  190.75,4.37 270 top
C201  1uf  [C1206K]  199.14,4.37 270 top
C204  .1uf  [C0603K]  213.61,4.37 270 top
C205  1uf  [C1206K]  222,4.37 270 top
D3  MBRS340T3  [SMC]  84.84,164.9 270 top
DGND  [1X01]  86.87,172.01 180 top
DGND1  [1X01]  77.47,183.18 0 top
DGND2  [1X01]  134.81,202.67 0 top
DGND3  [1X01]  157.99,122.73 0 top
DGND5  PINHD-1X1  [1X01']  343.66,130.61 180 top
HOUT1  [1X01]  5.33,3.35 0 top
HOUT3  [1X01]  25.65,3.35 0 top
HOUT5  [1X01]  48.51,3.35 0 top
HOUT7  [1X01]  71.37,3.35 0 top
HOUT9  [1X01]  94.23,3.35 0 top
HOUT11  [1X01]  119.63,3.35 0 top
HOUT13  [1X01]  145.03,3.35 0 top
HOUT15  [1X01]  170.43,3.35 0 top
HOUT17  [1X01]  193.29,3.35 0 top
HOUT19  [1X01]  216.15,3.35 0 top
IC1  OPA4344E  [TSSOP14]  85.09,141.53 0 top
IC2  OPA134D  [SO08]  291.08,133.65 90 top
IC3  STM32H743ZIT6  [QFP50P2200X2200X160-144N]  106.68,166.93 0 top
IC4  LMV321M5  [SOT23-5]  73.66,159.56 0 top
IC5  [78LXX]  311.91,142.04 0 top
IC6  [79LXX]  312.67,137.46 0 top
IC7  OPA4344E  [TSSOP14]  97.28,141.78 0 top
IC8  OPA4344E  [TSSOP14]  108.2,141.78 0 top
IC9  OPA4344E  [TSSOP14]  120.9,141.78 0 top
IC10  OPA4344E  [TSSOP14]  132.59,141.78 0 top
IC11  LP5912  [6-WSON]  77.98,167.94 90 top
IC12  REG1117  [SOT223]  73.91,173.79 90 top
IC13  REG1117  [SOT223]  112.21,210.03 0 top
IC14  REG1117  [SOT223]  122.88,210.03 0 top
IC15  REG1117  [SOT223]  341.88,267.77 90 top
IC17  OPA4344E  [TSSOP14]  73.41,141.27 0 top
IC18  REG1117  [SOT223]  181.86,117.65 90 top
IC20  REG1117  [SOT223]  165.86,118.67 180 top
J1  AUDIO_JACK_TRS_0.25"_PTH_RA  [AUDIO_JACK_0.25"_TRS_PTH_RA]  81.03,250.24 270 top
J2  4P-2.0  [HW4-2.0]  125.48,174.29 270 top
J3  4P-2.0  [HW4-2.0]  215.9,207.31 270 top
J4  4P-2.0  [HW4-2.0]  222.76,207.31 270 top
J5  4P-2.0  [HW4-2.0]  229.62,207.31 270 top
J6  4P-2.0  [HW4-2.0]  236.47,207.31 270 top
J7  4P-2.0  [HW4-2.0]  243.33,207.31 270 top
J8  4P-2.0  [HW4-2.0]  117.09,183.44 180 top
J9  4P-2.0-90D  [HW4-2.0-90D]  28.96,9.7 270 bottom
J10  4P-2.0  [HW4-2.0]  126.24,161.09 90 top
J11  4P-2.0  [HW4-2.0]  178.82,133.91 180 top
J12  4P-2.0  [HW4-2.0]  190.75,133.91 180 top
J13  4P-2.0  [HW4-2.0]  155.19,193.34 180 top
J14  4P-2.0  [HW4-2.0]  169.16,193.34 180 top
J15  4P-2.0  [HW4-2.0]  184.91,195.38 0 top
J16  4P-2.0  [HW4-2.0]  146.81,124.51 270 top
J17  4P-2.0  [HW4-2.0]  89.92,182.17 180 top
J18  4P-2.0  [HW4-2.0]  106.43,191.57 180 top
J19  4P-2.0  [HW4-2.0]  94.23,191.57 180 top
J20  4P-2.0  [HW4-2.0]  318.26,259.89 90 top
J21  4P-2.0  [HW4-2.0]  315.98,251 0 top
J22  4P-2.0  [HW4-2.0]  311.4,259.89 90 top
J23  4P-2.0  [HW4-2.0]  326.9,251 0 top
J24  4P-2.0  [HW4-2.0]  336.55,252.02 270 top
J25  4P-2.0-90D  [HW4-2.0-90D]  8.64,9.7 270 bottom
J26  4P-2.0  [HW4-2.0]  343.41,252.02 270 top
J27  4P-2.0-90D  [HW4-2.0-90D]  51.82,9.7 270 bottom
J29  4P-2.0-90D  [HW4-2.0-90D]  74.68,9.7 270 bottom
J31  4P-2.0-90D  [HW4-2.0-90D]  97.54,9.7 270 bottom
J33  4P-2.0-90D  [HW4-2.0-90D]  122.94,9.7 270 bottom
J35  4P-2.0-90D  [HW4-2.0-90D]  148.34,9.7 270 bottom
J37  4P-2.0-90D  [HW4-2.0-90D]  173.74,9.7 270 bottom
J39  4P-2.0-90D  [HW4-2.0-90D]  196.6,9.7 270 bottom
J41  4P-2.0-90D  [HW4-2.0-90D]  219.46,9.7 270 bottom
JP1  PINHD-2X8  [2X08]  39.62,90.22 270 top
JP2  PINHD-2X8  [2X08]  91.19,126.29 0 top
JP3  PINHD-2X4  [2X04]  281.94,100.89 90 top
JP4  PINHD-2X4  [2X04]  362.97,101.14 90 top
JP5  PINHD-2X4  [2X04]  399.54,162.86 90 top
JP6  PINHD-2X10  [2X10]  347.98,100.89 90 top
JP7  PINHD-2X10  [2X10]  429.01,101.14 90 top
JP8  PINHD-2X10  [2X10]  465.58,162.86 90 top
JP9  [2X15]  323.82,79.25 0 top
JP10  [2X15]  404.83,79.53 0 top
JP11  [2X15]  441.38,141.25 0 top
JP12  PINHD-1X2  [1X02]  260.1,146.35 0 top
JP13  PINHD-1X2  [1X02]  260.1,134.92 0 top
JP14  PINHD-1X2  [1X02]  287.02,143.81 0 top
JP15  PINHD-2X8  [2X08]  382.52,132.13 0 top
JP16  PINHD-2X8  [2X08]  201.93,195.88 0 top
JP17  PINHD-1X2  [1X02]  260.1,87.93 0 top
JP18  PINHD-1X2  [1X02]  260.1,123.49 0 top
JP19  PINHD-1X8  [1X08]  125.48,238.3 0 top
JP20  PINHD-1X2  [1X02]  88.65,220.52 90 top
JP21  PINHD-1X4  [1X04]  213.17,303.07 0 bottom
LED1  RED  [CHIP-LED0603]  90.17,178.36 270 top
LED2  GREEN  [CHIP-LED0603]  102.11,183.44 90 top
LED3  RED  [CHIP-LED0603]  208.79,137.21 270 top
LED4  RED  [CHIP-LED0603]  161.8,197.92 90 top
LED5  [P-LCC-2]  185.93,281.23 90 bottom
LED6  [P-LCC-2]  146.56,278.94 0 bottom
LED7  [P-LCC-2]  142.75,289.86 0 bottom
LED8  [P-LCC-2]  127.76,283.51 90 bottom
LED9  [P-LCC-2]  111.25,291.39 90 bottom
LED10  [P-LCC-2]  92.71,296.47 90 bottom
LED11  [P-LCC-2]  72.64,295.2 90 bottom
LED12  [P-LCC-2]  206.42,310.89 0 bottom
OPT1_A  PINHD-1X1  [1X01']  74.42,124.26 0 top
OPT1_B  PINHD-1X1  [1X01']  79.25,140 0 top
OPT2_A  PINHD-1X1  [1X01']  74.42,126.8 0 top
OPT2_B  PINHD-1X1  [1X01']  69.09,138.99 0 top
OPT3_A  PINHD-1X1  [1X01']  79.76,130.1 0 top
OPT3_B  PINHD-1X1  [1X01']  90.93,140.51 0 top
OPT4_A  PINHD-1X1  [1X01']  82.3,130.1 0 top
OPT4_B  PINHD-1X1  [1X01']  79.25,137.46 0 top
OPT5_A  PINHD-1X1  [1X01']  89.92,130.61 0 top
OPT5_B  PINHD-1X1  [1X01']  101.6,138.73 0 top
OPT6_A  PINHD-1X1  [1X01']  92.46,130.61 0 top
OPT6_B  PINHD-1X1  [1X01']  93.22,139.24 0 top
OPT7_A  PINHD-1X1  [1X01']  106.93,125.02 0 top
OPT7_B  PINHD-1X1  [1X01']  112.52,138.99 0 top
OPT8_A  PINHD-1X1  [1X01']  109.47,125.02 0 top
OPT8_B  PINHD-1X1  [1X01']  104.39,141.78 0 top
OPT9_A  PINHD-1X1  [1X01']  114.05,125.02 0 top
OPT9_B  PINHD-1X1  [1X01']  124.97,143.81 0 top
OPT10_A  PINHD-1X1  [1X01']  116.59,125.02 0 top
OPT10_B  PINHD-1X1  [1X01']  117.09,145.59 0 top
OPT11_A  PINHD-1X1  [1X01']  122.17,125.02 0 top
OPT11_B  PINHD-1X1  [1X01']  136.14,148.64 0 top
OPT12_A  PINHD-1X1  [1X01']  124.97,125.02 0 top
OPT12_B  PINHD-1X1  [1X01']  128.02,148.89 0 top
P1  P-10-100-2X05_M  [DIL-100-2X05_M]  142.49,219.51 180 bottom
P2  P-24-100-2X12_M  [DIL-100-2X12_M]  189.54,228.55 180 bottom
P3  M-1X03-SIP-100-40Y  [SIP-100-03-40Y]  81.28,197.66 90 top
P4  M-1X03-SIP-100-40Y  [SIP-100-03-40Y]  81.53,209.6 90 top
P5_2  [1X01]  186.69,129.34 180 top
P5_3  [1X01]  184.15,129.34 180 top
PA0  PINHD-1X1  [1X01']  79.25,142.54 0 top
PA1  PINHD-1X1  [1X01']  69.34,144.58 0 top
PA2  PINHD-1X1  [1X01']  90.93,143.05 0 top
PA3  PINHD-1X1  [1X01']  79.25,145.08 0 top
PA4  PINHD-1X1  [1X01']  101.35,144.32 0 top
PA5  PINHD-1X1  [1X01']  93.22,145.34 0 top
PA6  PINHD-1X1  [1X01']  112.52,144.58 0 top
PA7  PINHD-1X1  [1X01']  102.87,147.88 0 top
PB0  PINHD-1X1  [1X01']  124.46,152.96 0 top
PB1  PINHD-1X1  [1X01']  126.75,151.43 0 top
PC4  PINHD-1X1  [1X01']  124.46,149.66 0 top
PC5  PINHD-1X1  [1X01']  117.09,147.62 0 top
PGO1  [1X01]  6.35,16.05 0 top
PGO3  [1X01]  26.67,16.05 0 top
PGO5  [1X01]  49.53,16.05 0 top
PGO7  [1X01]  72.39,16.05 0 top
PGO9  [1X01]  95.25,16.05 0 top
PGO11  [1X01]  120.65,16.05 0 top
PGO13  [1X01]  146.05,16.05 0 top
PGO15  [1X01]  171.45,16.05 0 top
PGO17  [1X01]  194.31,16.05 0 top
PGO19  [1X01]  217.17,16.05 0 top
Q1  25MHz  [NX3225]  91.44,164.9 180 top
R1  10k  [RESC1608X60]  50.04,171.5 180 bottom
R2  100R  [RESC1608X60]  46.48,164.64 0 bottom
R3  10k  [RESC1608X60]  50.04,163.12 180 bottom
R4  47R  [R0603]  92.46,157.53 180 top
R5  10k  [R0402]  100.84,181.15 90 top
R6  100R  [RESC1608X60]  46.48,155.75 0 bottom
R7  10k  [RESC1608X60]  50.04,154.74 180 bottom
R8  100R  [RESC1608X60]  46.48,147.37 0 bottom
R9  1k  [R0603]  297.43,133.15 180 top
R10  1k  [R0603]  297.43,136.45 180 top
R11  1k  [R0603]  297.43,140.77 180 top
R12  10k  [RESC1608X60]  50.04,146.1 180 bottom
R13  1k  [R0603]  285.24,133.65 90 top
R14  0R_DNP  [R0603]  321.56,129.59 270 top
R15  0R_DNP  [R0603]  324.36,129.59 270 top
R16  100R  [RESC1608X60]  46.48,137.97 0 bottom
R17  10k  [RESC1608X60]  50.29,137.21 180 bottom
R18  100R  [RESC1608X60]  46.23,129.34 0 bottom
R19  10k  [RESC1608X60]  50.04,128.57 180 bottom
R20  100R  [RESC1608X60]  45.97,120.7 0 bottom
R21  10k  [RESC1608X60]  50.04,119.94 180 bottom
R22  100R  [RESC1608X60]  45.97,112.06 0 bottom
R23  10k  [RESC1608X60]  49.78,76 180 bottom
R24  100R  [RESC1608X60]  43.94,70.41 0 bottom
R25  10k  [RESC1608X60]  49.78,111.05 180 bottom
R26  100R  [RESC1608X60]  46.48,102.92 0 bottom
R27  10k  [RESC1608X60]  49.78,102.41 180 bottom
R28  100R  [RESC1608X60]  46.48,94.28 0 bottom
R29  10k  [RESC1608X60]  50.04,93.52 180 bottom
R30  100R  [RESC1608X60]  47.5,86.41 0 bottom
R31  10k  [RESC1608X60]  49.78,84.63 180 bottom
R32  100R  [RESC1608X60]  46.48,76.76 0 bottom
R33  20k  [R0603]  72.64,130.86 180 top
R34  20k  [R0603]  71.37,136.19 90 top
R35  820R  [R0603]  73.66,132.89 180 top
R36  820R  [R0603]  76.45,134.67 90 top
R37  0R  [R0603]  76.96,141.53 270 top
R38  20k  [R0603]  74.68,146.61 270 top
R39  20k  [R0603]  75.18,150.67 0 top
R40  820R  [R0603]  76.96,146.61 270 top
R41  820R  [R0603]  71.37,149.15 0 top
R42  0R  [R0603]  69.6,141.78 270 top
R43  100k  [R0603]  70.87,161.09 90 top
R44  100k  [R0603]  70.87,157.53 90 top
R45  20k  [R0603]  81.53,133.65 0 top
R46  20k  [R0603]  86.87,131.88 180 top
R47  820R  [R0603]  81.79,136.45 90 top
R48  820R  [R0603]  87.63,136.7 270 top
R49  0R  [R0603]  88.65,141.53 270 top
R50  20k  [R0603]  82.8,148.89 0 top
R51  20k  [R0603]  86.87,149.91 180 top
R52  820R  [R0603]  87.38,146.86 270 top
R53  820R  [R0603]  89.92,146.1 270 top
R54  0R  [R0603]  81.53,141.53 270 top
R55  20k  [R0603]  94.23,136.45 90 top
R56  20k  [R0603]  99.06,136.19 90 top
R57  820R  [R0603]  91.95,136.45 90 top
R58  820R  [R0603]  95.76,131.88 0 top
R59  0R  [R0603]  100.84,141.53 270 top
R60  20k  [R0603]  100.33,131.88 0 top
R61  20k  [R0603]  99.06,147.12 270 top
R62  33R  [R0201]  93.22,175.82 0 top
R63  820R  [R0603]  96.77,150.16 0 top
R64  820R  [R0603]  94.23,147.88 90 top
R65  0R  [R0603]  93.47,142.29 270 top
R66  20k  [R0603]  107.44,132.13 0 top
R67  20k  [R0603]  106.68,135.18 90 top
R68  820R  [R0603]  112.27,134.67 180 top
R69  820R  [R0603]  112.01,136.7 0 top
R70  0R  [R0603]  111.76,141.78 270 top
R71  20k  [R0603]  113.54,132.64 0 top
R72  20k  [R0603]  109.98,147.37 270 top
R73  820R  [R0603]  112.27,147.37 270 top
R74  820R  [R0603]  106.43,147.12 90 top
R75  0R  [R0603]  104.14,144.58 270 top
R76  20k  [R0603]  117.09,129.59 0 top
R77  20k  [R0603]  122.94,132.64 180 top
R78  820R  [R0603]  117.6,136.45 90 top
R79  560R  [R0603]  102.87,180.64 90 top
R80  820R  [R0603]  117.6,133.15 90 top
R81  33R  [R0201]  93.22,173.79 0 top
R82  0R  [R0603]  89.66,174.55 180 top
R83  33R  [R0201]  93.22,174.8 0 top
R84  33R  [R0201]  93.22,172.77 0 top
R85  0R  [R0603]  124.97,146.61 270 top
R86  0R_DNP  [R0603]  89.66,172.52 180 top
R87  0R_DNP  [R0603]  89.66,176.58 180 top
R88  20k  [R0603]  122.17,129.84 0 top
R89  20k  [R0603]  122.68,147.12 270 top
R90  820R  [R0603]  116.59,140.77 0 top
R91  820R  [R0603]  114.81,144.58 270 top
R92  0R  [R0603]  119.13,146.86 270 top
R93  20k  [R0603]  127.76,133.91 0 top
R94  20k  [R0603]  130.81,136.45 90 top
R95  820R  [R0603]  130.81,132.64 90 top
R96  820R  [R0603]  133.86,131.62 0 top
R97  0R  [R0603]  136.14,151.43 270 top
R98  20k  [R0603]  131.83,128.57 0 top
R99  20k  [R0603]  127.25,141.27 270 top
R100  820R  [R0603]  134.3,147.3 270 top
R101  820R  [R0603]  130.81,147.37 90 top
R102  0R  [R0603]  129.54,152.96 0 top
R103  0R  [R0603]  80.52,167.69 270 top
R104  560R  [R0603]  86.11,178.36 0 top
R105  33R  [R0402]  105.92,182.93 90 top
R106  33R  [R0402]  107.19,182.93 90 top
R107  33R  [R0402]  109.73,182.17 270 top
R108  0R_DNP  [R0603]  90.93,170.48 180 top
R109  33R  [R0402]  108.46,182.17 90 top
R110  0R  [R0603]  319.28,129.59 270 top
R111  0R  [R0603]  326.64,129.59 270 top
R112  0R  [R0603]  325.63,127.05 180 top
R113  10k  [R0603]  215.14,117.14 270 top
R114  10k  [R0603]  218.95,120.45 270 top
R115  10k  [R0603]  199.64,117.14 0 top
R116  0R  [R0603]  180.59,124.76 180 top
R117  33R  [R0201]  199.9,137.21 0 top
R118  33R  [R0201]  199.9,136.19 0 top
R119  33R  [R0201]  197.1,132.13 0 top
R120  10k  [R0603]  199.9,114.86 180 top
R121  33R  [R0201]  197.1,131.11 0 top
R122  33R  [R0201]  197.1,130.45 0 top
R123  560R  [R0603]  205.99,137.21 0 top
R124  33R  [R0201]  197.23,129.21 0 top
R125  1k  [R0603]  327.69,264.21 180 top
R126  4.7k  [R0603]  9.4,17.32 0 top
R127  4.7k  [R0603]  9.4,14.53 180 top
R128  560R  [R0603]  180.09,275.39 270 bottom
R129  560R  [R0603]  146.05,273.1 0 bottom
R130  0R  [R0603]  127.7,216.38 90 top
R131  4.7k  [R0603]  10.41,11.99 270 top
R132  0R_DNP  [R0603]  3.56,16.05 180 top
R133  0R  [R0603]  318.01,268.53 0 top
R134  1k  [R0603]  323.09,264.21 0 top
R135  560R  [R0603]  138.94,286.05 270 bottom
R136  560R  [R0603]  124.46,287.32 0 bottom
R137  560R  [R0603]  108.2,295.45 0 bottom
R138  560R  [R0603]  164.85,197.92 180 top
R139  560R  [R0603]  89.41,300.02 0 bottom
R140  560R  [R0603]  70.1,299.26 90 bottom
R141  560R  [R0603]  210.66,305.78 180 bottom
R142  1.5k  [R0603]  206.5,226.87 0 top
R143  0R  [R0603]  191.26,304.09 0 bottom
R144  0R  [R0603]  191.26,299.01 0 bottom
R145  0R_DNP  [R0603]  191.26,296.21 180 bottom
R146  0R_DNP  [R0603]  191.26,301.55 180 bottom
R147  1.5k  [R0603]  206.5,229.67 0 top
R148  1.5k  [R0603]  144.78,226.11 270 top
R149  1.5k  [R0603]  149.61,228.4 270 top
R150  1.5k  [R0603]  338.58,264.46 180 top
R151  1.5k  [R0603]  346.96,255.57 270 top
R152  1.5k  [R0603]  139.19,236.02 180 top
R153  1.5k  [R0603]  144.02,236.52 0 top
R154  1.5k  [R0603]  152.65,232.21 0 top
R155  1.5k  [R0603]  153.16,234.49 0 top
R156  1.5k  [R0603]  131.57,233.73 0 top
R157  1.5k  [R0603]  128.27,233.73 0 top
R158  1k  [R0603]  210.31,207.06 270 top
R163  4.7k  [R0603]  29.72,17.32 0 top
R164  4.7k  [R0603]  29.72,14.53 180 top
R165  4.7k  [R0603]  30.73,11.99 270 top
R166  0R_DNP  [R0603]  23.88,16.05 180 top
R171  4.7k  [R0603]  52.58,17.32 0 top
R172  4.7k  [R0603]  52.58,14.53 180 top
R173  4.7k  [R0603]  53.59,11.99 270 top
R174  0R_DNP  [R0603]  46.74,16.05 180 top
R179  4.7k  [R0603]  75.44,17.32 0 top
R180  4.7k  [R0603]  75.44,14.53 180 top
R181  4.7k  [R0603]  76.45,11.99 270 top
R182  0R_DNP  [R0603]  69.6,16.05 180 top
R187  4.7k  [R0603]  98.3,17.32 0 top
R188  4.7k  [R0603]  98.3,14.53 180 top
R189  4.7k  [R0603]  99.31,11.99 270 top
R190  0R_DNP  [R0603]  92.46,16.05 180 top
R195  4.7k  [R0603]  123.7,17.32 0 top
R196  4.7k  [R0603]  123.7,14.53 180 top
R197  4.7k  [R0603]  124.71,11.99 270 top
R198  0R_DNP  [R0603]  117.86,16.05 180 top
R203  4.7k  [R0603]  149.1,17.32 0 top
R204  4.7k  [R0603]  149.1,14.53 180 top
R205  4.7k  [R0603]  150.11,11.99 270 top
R206  0R_DNP  [R0603]  143.26,16.05 180 top
R211  4.7k  [R0603]  174.5,17.32 0 top
R212  4.7k  [R0603]  174.5,14.53 180 top
R213  4.7k  [R0603]  175.51,11.99 270 top
R214  0R_DNP  [R0603]  168.66,16.05 180 top
R219  4.7k  [R0603]  197.36,17.32 0 top
R220  4.7k  [R0603]  197.36,14.53 180 top
R221  4.7k  [R0603]  198.37,11.99 270 top
R222  0R_DNP  [R0603]  191.52,16.05 180 top
R227  4.7k  [R0603]  220.22,17.32 0 top
R228  4.7k  [R0603]  220.22,14.53 180 top
R229  4.7k  [R0603]  221.23,11.99 270 top
R230  0R_DNP  [R0603]  214.38,16.05 180 top
S1  MOMENTARY-SWITCH-SPST-PTH-6.0MM  [TACTILE_SWITCH_PTH_6.0MM]  127.53,276.58 0 bottom
S2  MOMENTARY-SWITCH-SPST-PTH-6.0MM  [TACTILE_SWITCH_PTH_6.0MM]  111.35,284.56 0 bottom
S3  MOMENTARY-SWITCH-SPST-PTH-6.0MM  [TACTILE_SWITCH_PTH_6.0MM]  92.91,289.59 0 bottom
S4  MOMENTARY-SWITCH-SPST-PTH-6.0MM  [TACTILE_SWITCH_PTH_6.0MM]  72.62,288.65 0 bottom
S5  MOMENTARY-SWITCH-SPST-PTH-6.0MM  [TACTILE_SWITCH_PTH_6.0MM]  178.03,302.06 0 bottom
S6  MOMENTARY-SWITCH-SPST-PTH-6.0MM  [TACTILE_SWITCH_PTH_6.0MM]  178.31,287.22 0 bottom
S7  MOMENTARY-SWITCH-SPST-PTH-6.0MM  [TACTILE_SWITCH_PTH_6.0MM]  172.57,294.56 0 bottom
S8  MOMENTARY-SWITCH-SPST-PTH-6.0MM  [TACTILE_SWITCH_PTH_6.0MM]  183.46,294.61 0 bottom
S9  MOMENTARY-SWITCH-SPST-PTH-6.0MM  [TACTILE_SWITCH_PTH_6.0MM]  186.03,275.26 0 bottom
S10  MOMENTARY-SWITCH-SPST-PTH-6.0MM  [TACTILE_SWITCH_PTH_6.0MM]  153.59,278.74 0 bottom
S11  MOMENTARY-SWITCH-SPST-PTH-6.0MM  [TACTILE_SWITCH_PTH_6.0MM]  149.63,289.89 0 bottom
S12  MOMENTARY-SWITCH-SPST-PTH-6.0MM  [TACTILE_SWITCH_PTH_6.0MM]  214.14,310.71 0 bottom
SW1  PEC11R-4215F-S0024  [PEC11R-4215F-S0024]  157.73,309.42 0 bottom
U1  CY8C5868AXI-LP035  [TQFP-100-14X14MM]  207.01,127.3 270 top
U2  CY8C5868AXI-LP035  [TQFP-100-14X14MM]  173.48,209.85 0 top
U3  [QRE1113]  48.26,168.2 90 bottom
U4  [QRE1113]  48.26,159.56 90 bottom
U5  [QRE1113]  48.26,150.93 90 bottom
U6  [QRE1113]  48.26,142.04 90 bottom
U7  [QRE1113]  48.26,133.4 90 bottom
U8  [QRE1113]  48.26,124.51 90 bottom
U9  [QRE1113]  48.26,115.87 90 bottom
U10  [QRE1113]  48.26,106.98 90 bottom
U11  [QRE1113]  48.26,98.35 90 bottom
U12  [QRE1113]  48.26,89.71 90 bottom
U13  [QRE1113]  48.01,80.82 90 bottom
U14  [QRE1113]  48.01,72.19 90 bottom
U15  R-78E5.0-1.0  [DC-DC_CONVERTER_78XX]  111.76,226.36 180 top
U16  TEXAS_TPS2051B  [TEXAS_SOT23-5]  43.69,80.06 0 bottom
U17  R-78E5.0-1.0  [DC-DC_CONVERTER_78XX]  362.97,135.43 90 top
U18  R-78E5.0-1.0  [DC-DC_CONVERTER_78XX]  352.04,135.18 90 top
U19  TCA9548APWR  [SOP65P640X120-24N]  204.98,210.62 180 top
U20  TCA9548APWR  [SOP65P640X120-24N]  327.91,258.88 0 top
U22  AS5600  [SOIC8-1.27-5X4MM]  4.57,9.96 0 top
U23  AS5600  [SOIC8-1.27-5X4MM]  24.89,9.96 0 top
U25  AS5600  [SOIC8-1.27-5X4MM]  47.75,9.96 0 top
U27  AS5600  [SOIC8-1.27-5X4MM]  70.61,9.96 0 top
U29  AS5600  [SOIC8-1.27-5X4MM]  93.47,9.96 0 top
U31  AS5600  [SOIC8-1.27-5X4MM]  118.87,9.96 0 top
U33  AS5600  [SOIC8-1.27-5X4MM]  144.27,9.96 0 top
U35  AS5600  [SOIC8-1.27-5X4MM]  169.67,9.96 0 top
U37  AS5600  [SOIC8-1.27-5X4MM]  192.53,9.96 0 top
U39  AS5600  [SOIC8-1.27-5X4MM]  215.39,9.96 0 top
U$1  RK09  [RK09]  115.06,309.17 0 bottom
U$2  RK09  [RK09]  77.98,309.68 0 bottom
U$3  CMR0512S3C  [CMR0512S3C]  328.93,140 0 top
U$6  SS-7188VS-A-FLS  [SS-7188VS-A-FLS_RJ45]  328.42,274.12 180 bottom
U$9  P82B96DP,118  [SO8]  146.05,232.71 90 top
U$10  P82B96DP,118  [SO8]  342.39,260.91 270 top
U$11  2.1MMJACKTHM  [PJ-102A]  109.22,245.67 0 top
VREGGND  PINHD-1X1  [1X01']  324.1,132.38 90 top
VREGIN  PINHD-1X1  [1X01']  321.56,132.38 90 top
X1  3221-10-0300-00  [3221-10-0300-00]  146.05,206.04 270 top
X2  3221-10-0300-00  [3221-10-0300-00]  133.86,169.72 90 top
X3  3221-10-0300-00  [3221-10-0300-00]  157.99,134.67 180 top
X4  GLX-S-88M  [GLX-S-88M]  146.81,245.67 0 top
X5  2524-  [PAK100/2500-24]  184.66,310.51 0 top
X6  2520-  [PAK100/2500-20]  241.81,125.78 270 top
X7  2520-  [PAK100/2500-20]  227.08,125.78 270 top
X8  2510-  [PAK100/2500-10]  137.62,301.46 0 top

## Tracks (layer width: path | path; a pad name or v marks a point on that pad's centre or on a via)
3V3  (via drill 0.35)
  Top 0.305: C99.1 IC7.4 97.28,141.02 v96.38,141.92 | C101.1 108.2,137.35 IC8.4 v108.2,140.51 | C103.1 IC9.4 v120.9,140.51 | C105.1 IC10.4 v132.59,140.26 | C41.1 IC1.4 85.09,139.88 84.97,140 v84.97,140.26 | C45.1 IC17.4 v73.41,140
  Top 0.61: R43.2 71.07,161.74 | C43.1 73.01,161.17 IC4.5 72.71,161.53 72.39,161.85 72.28,161.74
  Top 0.813: 72.28,161.74 72.28,162.1 70.87,162.1 | 70.87,162.1 R43.2 | C31.1 69.23,161.74 69.6,162.1 70.87,162.1
  Top 1.27: IC4.5 72.71,161.38 72.14,161.95 72.14,162.61 v71.63,163.12
  Route15 0.305: 132.21,139.88 v132.59,140.26 | 108.2,140 v108.2,140.51 | 85.09,139.5 84.97,139.62 v84.97,140.26
  Route15 0.508: 100.84,141.27 98.25,141.27 98.15,141.18 97.13,141.18 v96.38,141.92
  Route15 1.27: v71.63,163.12 68.83,160.32 68.83,146.86 67.56,145.59 67.56,143.31 70.39,140.48 70.39,140.25 71.11,139.52 71.35,139.52 71.88,138.99 71.88,138.73 72.39,138.73 73.66,140 75.21,138.45 75.21,136.95 76.73,135.43 81.03,135.43 85.09,139.5 88.9,139.5 92.71,135.69 92.71,133.65 97.54,128.83 JP2.14 | 100.84,141.27 101.36,141.27 102.63,140 108.2,140 111.51,136.7 115.32,136.7 119.13,140.51 v120.9,140.51 120.93,140.48 120.93,140.25 122.2,138.99 131.32,138.99 132.21,139.88
  pour Route15 (isolate 0.813): 65.28,168.2 82.04,168.2 82.04,161.09 102.62,161.09 106.43,157.28 106.43,153.72 109.98,150.16 118.87,150.16 123.19,154.48 136.65,154.48 138.94,152.2 138.94,121.72 65.79,121.72 65.28,122.22
3V3A
  Top 0.254: C65.1 94.46,159.31 94.83,159.67 IC3.33 | C116.1 76.45,166.68 76.2,166.42
  Top 0.305: 76.33,166.55 76.45,166.67
  Top 0.406: IC11.1 76.91,166.55 76.33,166.55 76.2,166.42 76.14,166.48 C113.1
  Top 0.61: R4.1 93.31,159.28 C65.1 93.34,157.14 91.95,155.75 91.44,155.75
  Top 0.813: C113.1 74.93,165.91
  Top 1.016: C110.1 73.57,165.91 74.93,165.91 76.2,165.91 | 91.44,155.75 89.66,155.75 87.38,158.04 87.12,158.04
  Top 1.27: C110.1 72.9,165.57 72.9,165.4 71.24,165.4 C111.1 68.17,165.53 C112.+ | 77.47,164.13 3V3A.1
  Top 1.905: 3V3A.1 76.2,165.91
  Top 2.54: 77.47,164.13 77.47,162.36 78.49,161.34 81.03,161.34 81.17,161.2 D3.A 84.84,160.32 87.12,158.04
3V3A2  (via drill 0.65)
  Top 0.254: C124.1 209.41,117.02 209.03,117.4 | U1.65 208.02,119.3 208.02,118.41 209.03,117.4 | 209.03,117.4 v210.82,117.4
  Top 1.016: C124.1 210.82,115.23 210.82,114.37 C125.1 | IC18.2 185.04,117.65 187.06,117.65 C152.1 187.82,118.14 C153.1 194.33,118.14 195.58,116.89 3V3A_2.1
  Top 1.27: 180.09,117.65 185.04,117.65 | 189.23,119.43 189.23,118.39 C153.1
  Top 2.54: IC18.PAD 178.71,118.77 178.56,118.92 181.61,118.92 181.61,114.35 175.51,114.35 175.51,117.4 177.29,119.18 178.05,119.18 178.05,116.13 177.8,115.87 180.09,115.87 180.09,117.65 | 188.98,119.43 189.23,119.43
  pour Route15 (no thermals): 173.99,112.57 174.24,112.83 174.24,118.16 181.86,125.78 200.41,125.78 202.69,123.49 223.52,123.49 223.52,137.97 230.12,137.97 230.12,112.57
3V3A4  (via drill 0.35)
  Top 0.254: C137.1 185.42,213.41 184.29,212.28 C136.1 184.16,211.38 183.65,210.86 U2.65 180.09,210.85 179.83,210.6 179.83,210.11 v178.82,209.09
  Top 1.27: 121.86,204.44 122.62,204.44 122.9,204.72 IC14.2 122.9,213.16 IC14.PAD 123.89,212.17 123.89,210.54 124.4,210.03 3V3A_1.1 | 121.86,204.44 C134.1 | 121.86,204.44 121.86,201.63 C135.1 121.84,201.65 121.84,197.78 121.83,197.83 120.4,196.39 105.66,196.39 95,207.06 P4.1 85.34,207.06 85.85,206.55 85.85,197.15 83.82,195.12 P3.1
  Bottom 0.813: v178.82,209.09 174.5,209.09 172.97,210.62 157.73,210.62 155.96,212.39 147.83,212.39 144.4,215.82
  Bottom 1.016: 3V3A_1.1 138.61,210.03 144.4,215.82 145.03,216.46 P1.7
3V3D2  (via drill 0.65)
  Top 0.254: U1.75 214.9,119.3 C133.1 214.8,119.52 v213.87,120.45 | U1.88 216.57,127.3 C154.1 217.03,128.18 217.7,128.85 v217.7,129.11 | C150.1 215.01,134.91 U1.100 214.91,133.4 213.36,133.4 v213.11,133.15 | U1.26 199.01,133.4 C148.1 | C151.1 197.61,128.32 198.11,127.81 U1.37 200.67,127.8 v200.91,127.56 | C149.1 198.74,121.04 U1.50 198.91,121.21 196.85,121.21 196.8,121.25 v195.07,121.25
  Top 0.813: v162.56,136.45 160.62,136.45 X3.1 | C148.1 198.64,134.44 198.77,134.81 198.91,134.67 v199.9,134.67
  Top 1.016: IC20.PAD 169.82,115.52 3V3D2.1 | IC20.2 165.84,123.84 C157.1 165.5,124 165.35,124.14 165.35,126.26 C161.1
  Top 1.27: C161.1 164.59,125.5 164.59,124.76 163.58,124.76 v163.58,124.51
  Top 2.54: IC20.PAD 163.68,115.52 161.29,117.91 161.29,118.67 150.11,118.67 152.65,116.13 | 163.07,116.38 171.96,116.38 171.96,114.1 171.72,113.85 151.14,113.85 153.03,115.75 152.65,116.13 | 152.65,116.13 161.8,116.13
  Route15 0.254: v195.07,121.25 195.07,127.05 195.33,127.3
  Route15 0.813: v213.87,120.45 213.87,124.76 213.61,125.02
  Route15 1.27: v163.58,124.51 164.59,124.51 166.62,122.48
  pour Route15 (no thermals): 140.97,139.24 222.76,139.24 222.76,124.51 202.95,124.51 200.66,126.8 181.61,126.8 173.23,118.41 173.23,113.33 172.72,112.83 141.99,112.83 140.97,113.84
3V3D3  (via drill 0.55)
  Top 0.152: IC15.PAD 338.73,266.79 338.69,266.75
  Top 0.305: R125.1 329.02,264.21 U20.24 332.33,262.45
  Top 0.406: R134.2 v325.37,264.21
  Top 0.61: R150.2 337.73,265.9 338.84,267 338.84,267.66 IC15.PAD | R151.2 346.96,251.76 346.22,251.02 J26.3
  Top 0.813: C162.1 332.26,262.52 C164.1 | C164.1 330.57,264.21 v330.45,264.21 | 332.33,262.45 332.74,262.45 C164.1
  Top 1.016: 338.73,267.98 IC15.PAD | J22.3 313.67,260.89 314.45,261.67 314.17,261.95 C168.1 | C167.1 345.2,267.63 IC15.2
  Top 1.27: IC15.2 338.76,267.79 IC15.PAD | 338.69,266.75 v341.88,266.75
  pour Route15 (isolate 0.508): 307.85,282.5 347.47,282.5 347.47,245.92 307.85,245.92
3V3D5  (via drill 0.35, 0.55)
  Top 0.254: C142.1 172.97,219.25 173.47,218.75 173.47,217.86 U2.88 v173.48,215.7 | C144.1 181.86,216.24 U2.75 181.39,215.95 v179.58,215.95 | C141.1 180.35,201.85 U2.50 180.59,201.85 v180.59,202.74 | U2.37 172.98,200.31 C146.1 | U2.26 167.01,201.85 166.88,201.73 | U2.100 166.88,217.85 | 166.88,217.85 166.36,217.85 C143.1 | 166.88,217.85 166.37,217.35 166.37,216.97 v166.62,216.71 | R158.2 215.8,206.21 J3.3
  Top 0.406: U19.24 202.07,207 202.07,206.3 C165.1 202.83,204.4 202.07,203.64 C169.1
  Top 0.61: v179.58,215.95 178.83,215.95 176.54,213.66 v175.77,213.66
  Top 0.813: C165.1 v201.42,205.54 | X1.1 141.48,208.58 v140.97,209.09 | C145.1 166.62,201.47 166.88,201.73 166.62,201.73 166.12,202.23 v166.12,202.74 | C146.1 174.05,199.81 174.75,199.1 v174.75,198.68 | R147.2 207.35,228.14 | 207.35,228.14 R142.2 | 207.35,228.14 208.03,228.14 v208.28,228.4
  Top 1.016: R148.2 146.56,225.26 v146.56,225.35 | R149.2 153.33,227.55 v153.92,228.14
  Top 1.27: v115.32,201.22 115.32,201.47 114.65,201.47 C130.1 113.71,203.57 113.08,204.19 C128.1 112.49,204.28 112.49,206.63 IC13.2 112.21,206.91 IC13.PAD
  Bottom 0.152: v175.77,213.66 175.68,213.66
  Bottom 0.813: v173.48,215.7 173.48,214.17 173.99,213.66 175.68,213.66 175.72,213.71
  pour Route15 (isolate 0.508, rank 2): 113.79,190.04 113.79,204.77 117.09,201.47 117.09,199.95 128.52,199.95 133.6,205.03 133.6,218.74 140.72,225.86 150.88,225.86 158.75,233.73 224.03,233.73 225.81,231.95 226.31,231.95 246.89,211.38 246.89,194.36 242.57,190.04
5VD2
  Top 1.016: IC20.3 162.97,121.82 159.51,125.27 5VD2.1 157.76,125.5 C160.1 150.49,125.5 C156.1 150.24,125.51 J16.2 J16.1
  Top 1.27: IC20.3 163.55,119.71 164.34,118.92 171.96,118.92 175.01,121.97 183.01,121.97 IC18.3
5VD4  (via drill 0.35, 0.55)
  Top 0.61: U$9.8 143.45,228.96 C166.1 143.4,230.68 143.49,230.78 145.64,230.78 v145.8,230.94
  Top 1.016: U15.VOUT 109.36,226.51 C127.1 108.74,229.41 C129.1 | R153.2 144.87,237.96 144.02,238.81 144.02,240.58 X4.2 | R154.2 154.01,232.71 R155.2 154.01,235.93 v153.67,236.27 | R152.2 v137.16,236.02
  Top 1.27: IC14.3 127.37,204.7 5VD1.1 | 116.78,204.7 v116.78,204.95 116.45,204.95 IC13.3 114.72,207.08 114.77,207.08 116.06,208.37 | 108.71,225.86 109.36,226.51
  Top 2.54: 108.71,225.86 108.71,223.32 109.17,222.86 109.27,222.86 116.06,216.07 116.06,208.37
  Route15 1.016: v153.67,236.27 151.89,236.27 148.34,239.83 X4.6
  Route15 2.54: U15.VOUT 109.22,221.54
  pour Route15 (isolate 0.508): 111,221.79 115.57,221.79 117.6,223.82 117.6,247.45 155.7,247.45 156.21,246.94 156.21,233.48 156.72,232.97 150.88,227.13 140.46,227.13 132.59,219.25 132.59,205.67 127.76,200.85 120.4,200.85 114.81,206.44 111.34,204.8 111.25,202.63 111.51,202.37 111.51,190.04 73.91,190.04 73.41,190.55 73.41,212.39 74.42,213.41 96.77,213.41 101.63,218.11 101.31,226.96
12VD2
  Route15 2.54: U15.VIN 114.3,221.78 104.96,212.44 104.96,202.69 117.09,190.55 188.98,190.55 JP16.1
  pour Route15 (isolate 0.508): 101.24,247.19 110.74,247.19 115.61,242.33 115.83,225.04 114.53,223.74 110.9,223.74 101.18,229.11
+1.8V  (via drill 0.35)
  Top 0.254: C73.2 C100.1 97.48,147.97 R61.1 | v128.5,141.87 127.51,141.87 R99.1
  Top 0.305: C26.2 75.04,130.86 74.42,130.86 | 73,151.77 74.09,150.67 R39.1 | C35.2 88.53,132.69 R46.1 | R51.1 87.86,150.05 C39.2 88.71,151 88.57,151 v88.39,151.18 | 109.55,134.85 109.02,134.33 v107.95,134.33 R67.1 | 109.55,134.85 C77.2 | C101.2 109.4,134.85 109.55,134.85 | R72.1 109.53,147.77 C102.1 108.2,149.28 C81.2 107.44,150.73 v107.75,150.42 | C103.2 121.41,135.54 C85.2 123.79,135.2 123.79,134.05 | 123.79,134.05 R77.1 | C93.2 132.89,134.23 132.89,135.5 C105.2 132.19,135.8 131.83,135.43 130.98,135.43 R94.1 130.81,135.04 131.33,134.52 v131.83,134.52 | 73.23,147.57 73.15,147.65 C46.1 73.15,147.5 73.27,147.62 | 73.15,147.4 73.27,147.28 73.27,147.62 | 73.27,147.62 v73.27,148.29 | v73.45,151.91 73.31,151.77 73,151.77 | C29.2 72.96,151.77 73,151.77 | C42.1 85.34,147.62 84.92,148.05 v84.82,148.05 | C73.2 v96.01,148.89 | C62.2 v98.04,133.91 | C104.1 121.36,147.97 R89.1 121.85,147.97 v121.07,148.75 | 123.79,134.05 v123.64,133.91 | C106.1 132.32,147.78 v132.32,148.79 | C97.2 129.03,142.4 v128.5,141.87 | C89.2 115.2,148.27 v115.82,148.89
  Top 0.406: R56.1 98.86,135.54 97.54,135.54 C99.2 97.28,134.27 C62.2 | C45.2 73.41,134.42 v73.15,134.42 | IC4.4 74.61,158.55 IC4.3 | C35.2 88.53,134.65 v88.64,134.75 | C41.2 86.06,136.05 v86.19,135.92
  Top 0.61: IC4.3 74.75,158.11 75.33,158.11 C44.1 | C43.2 74.61,162.06 IC4.4 | C44.1 75.33,158.55 74.61,158.55 | C44.1 75.44,156.26 75.44,159.31 | R33.1 74.42,130.86 v74.42,129.84
  Top 1.27: 75.44,159.31 v75.69,159.31
  Route2 0.406: v73.15,134.42 73.15,134.16
  Route2 1.27: v75.69,159.31 75.69,150.93
  pour Route2 (isolate 0.813): 65.79,121.21 138.68,121.21 138.68,152.45 87.12,152.96 86.36,152.96 78.49,160.83 74.17,160.83 65.79,152.45
+3V3  (via drill 0.35, 0.65)